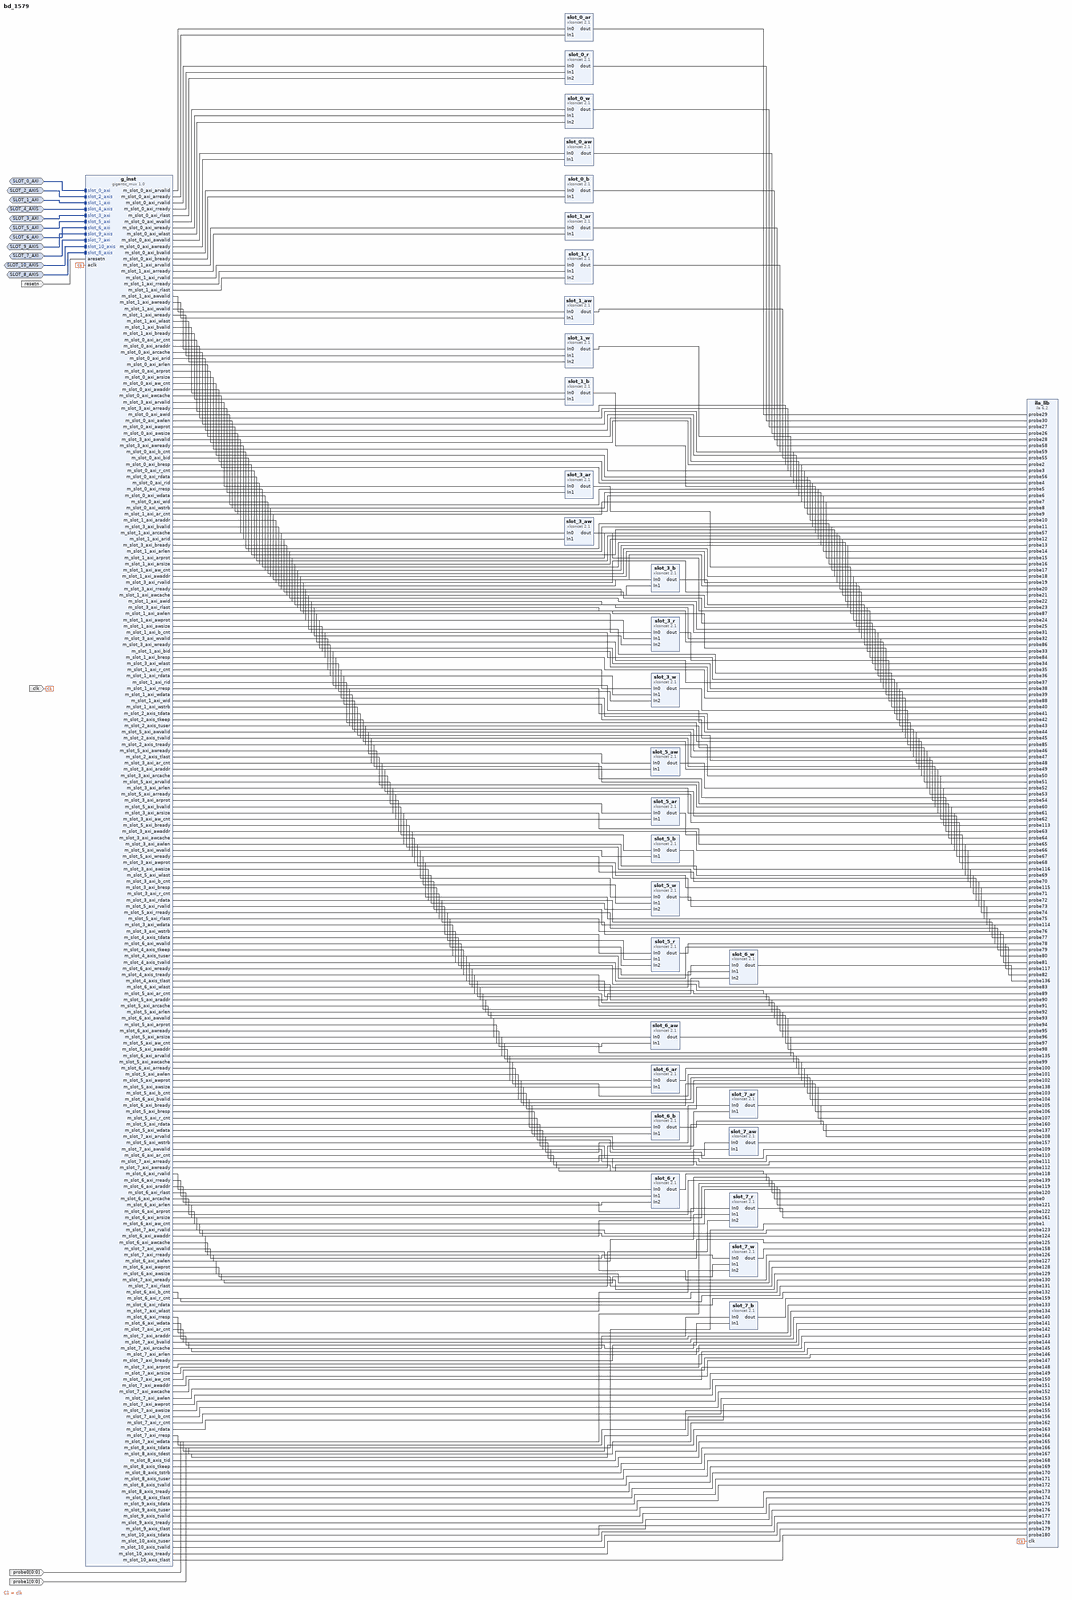
[diagram p0: block diagram of the top level, whole]
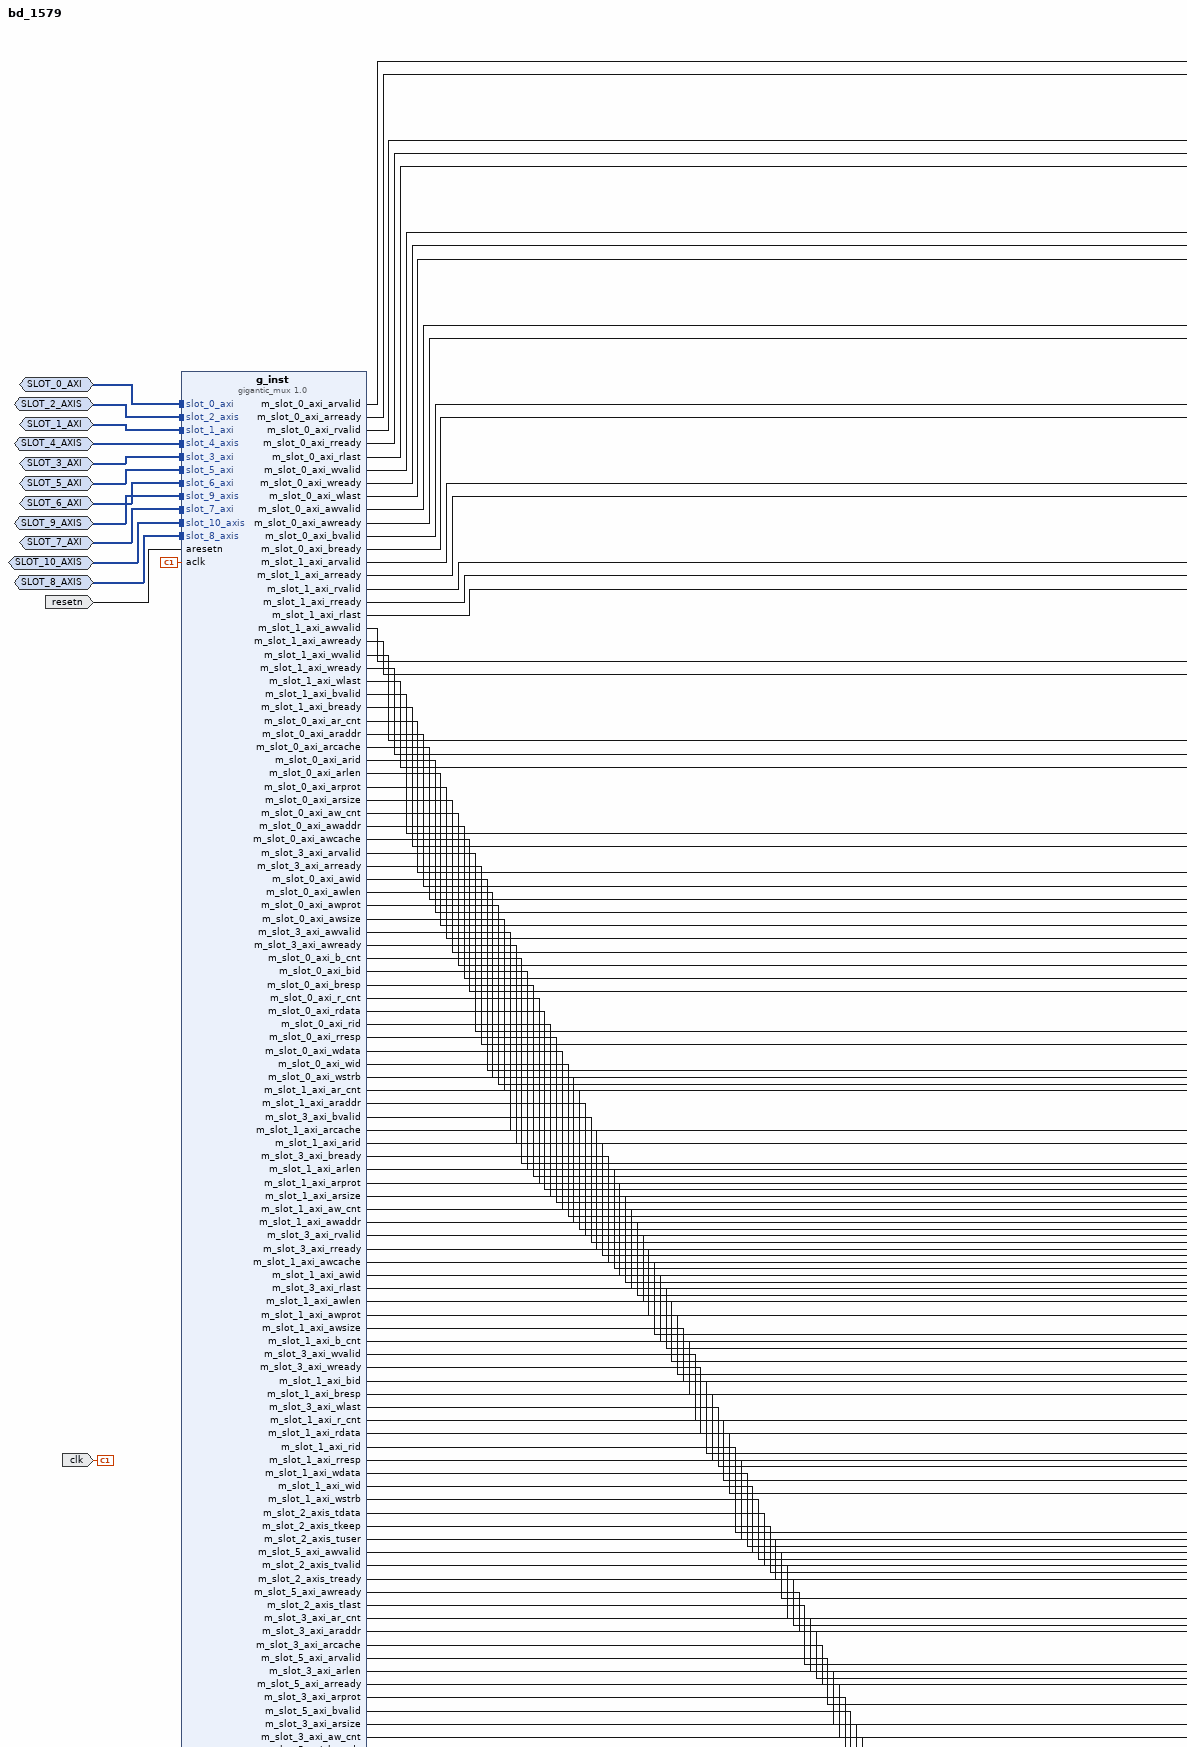
[diagram p1: block diagram of the top level, upper left part]
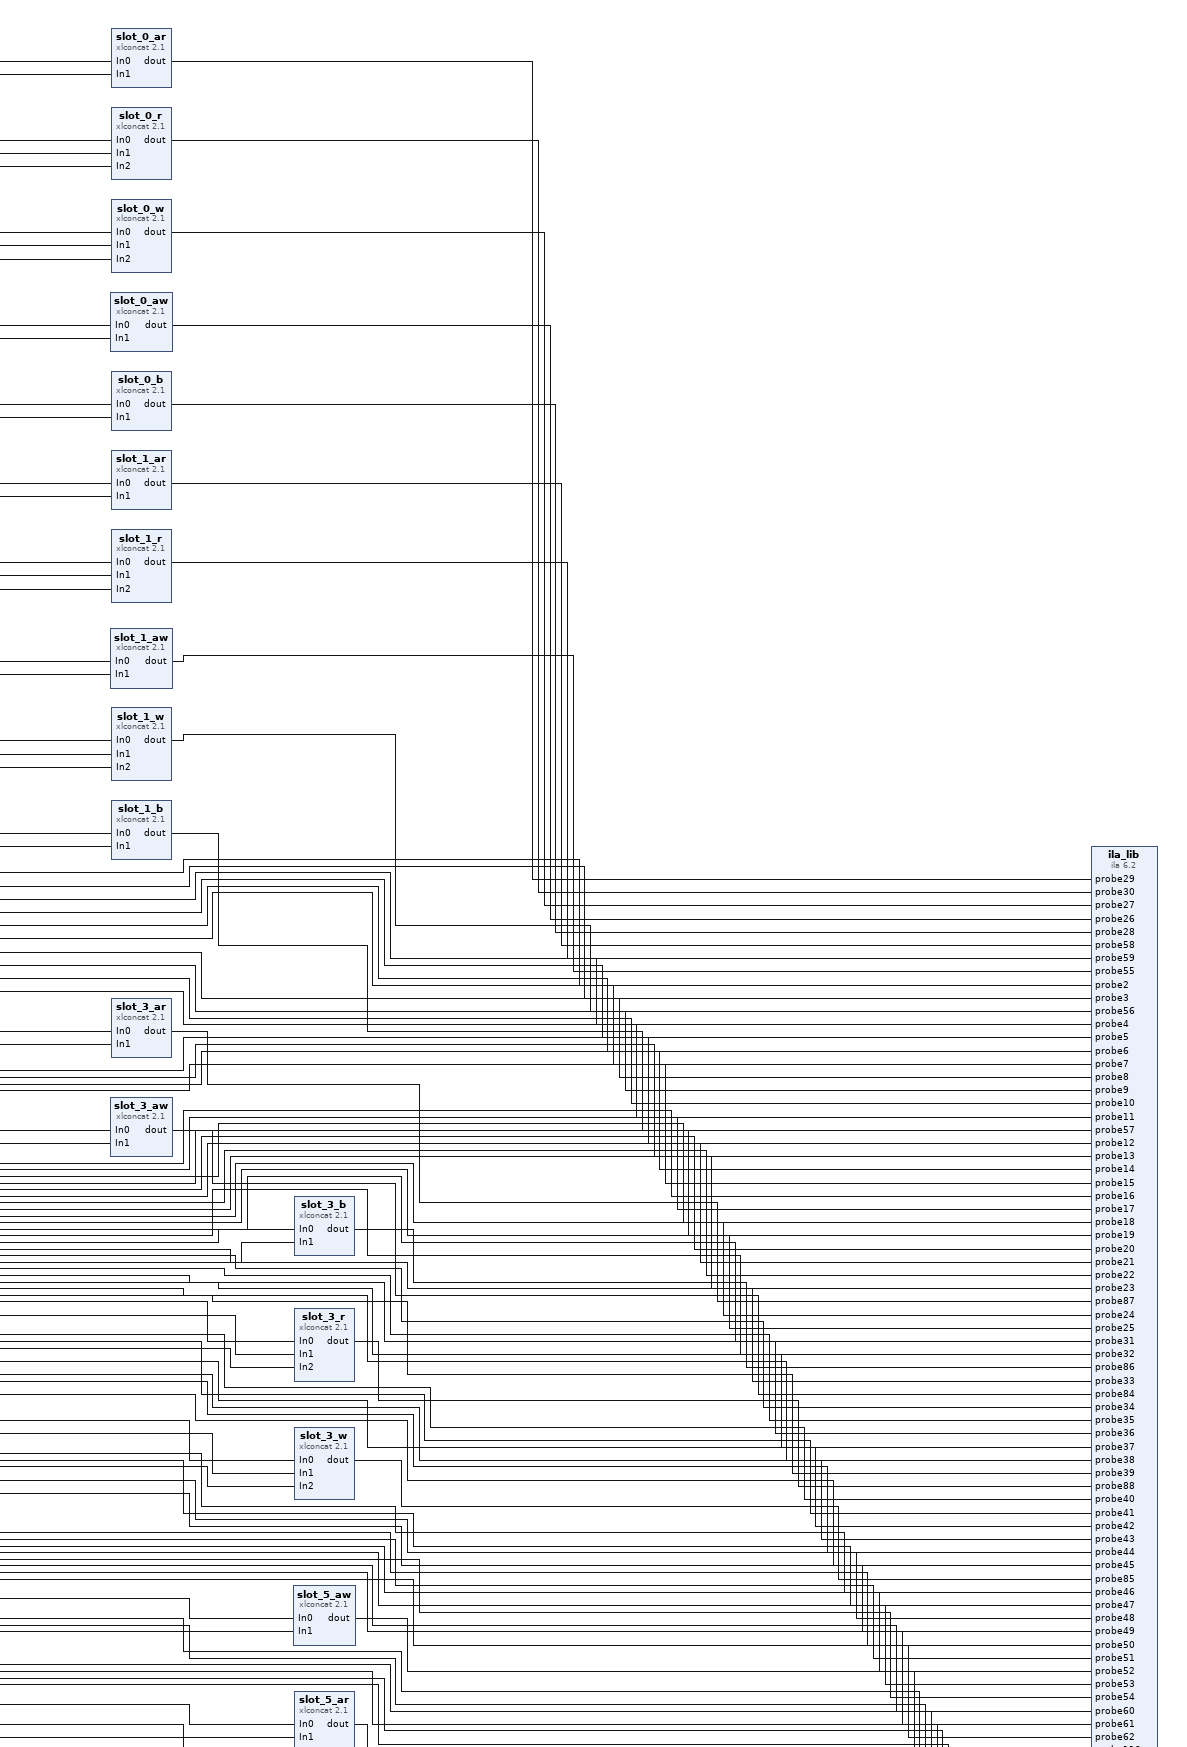
[diagram p2: block diagram of the top level, upper right part]
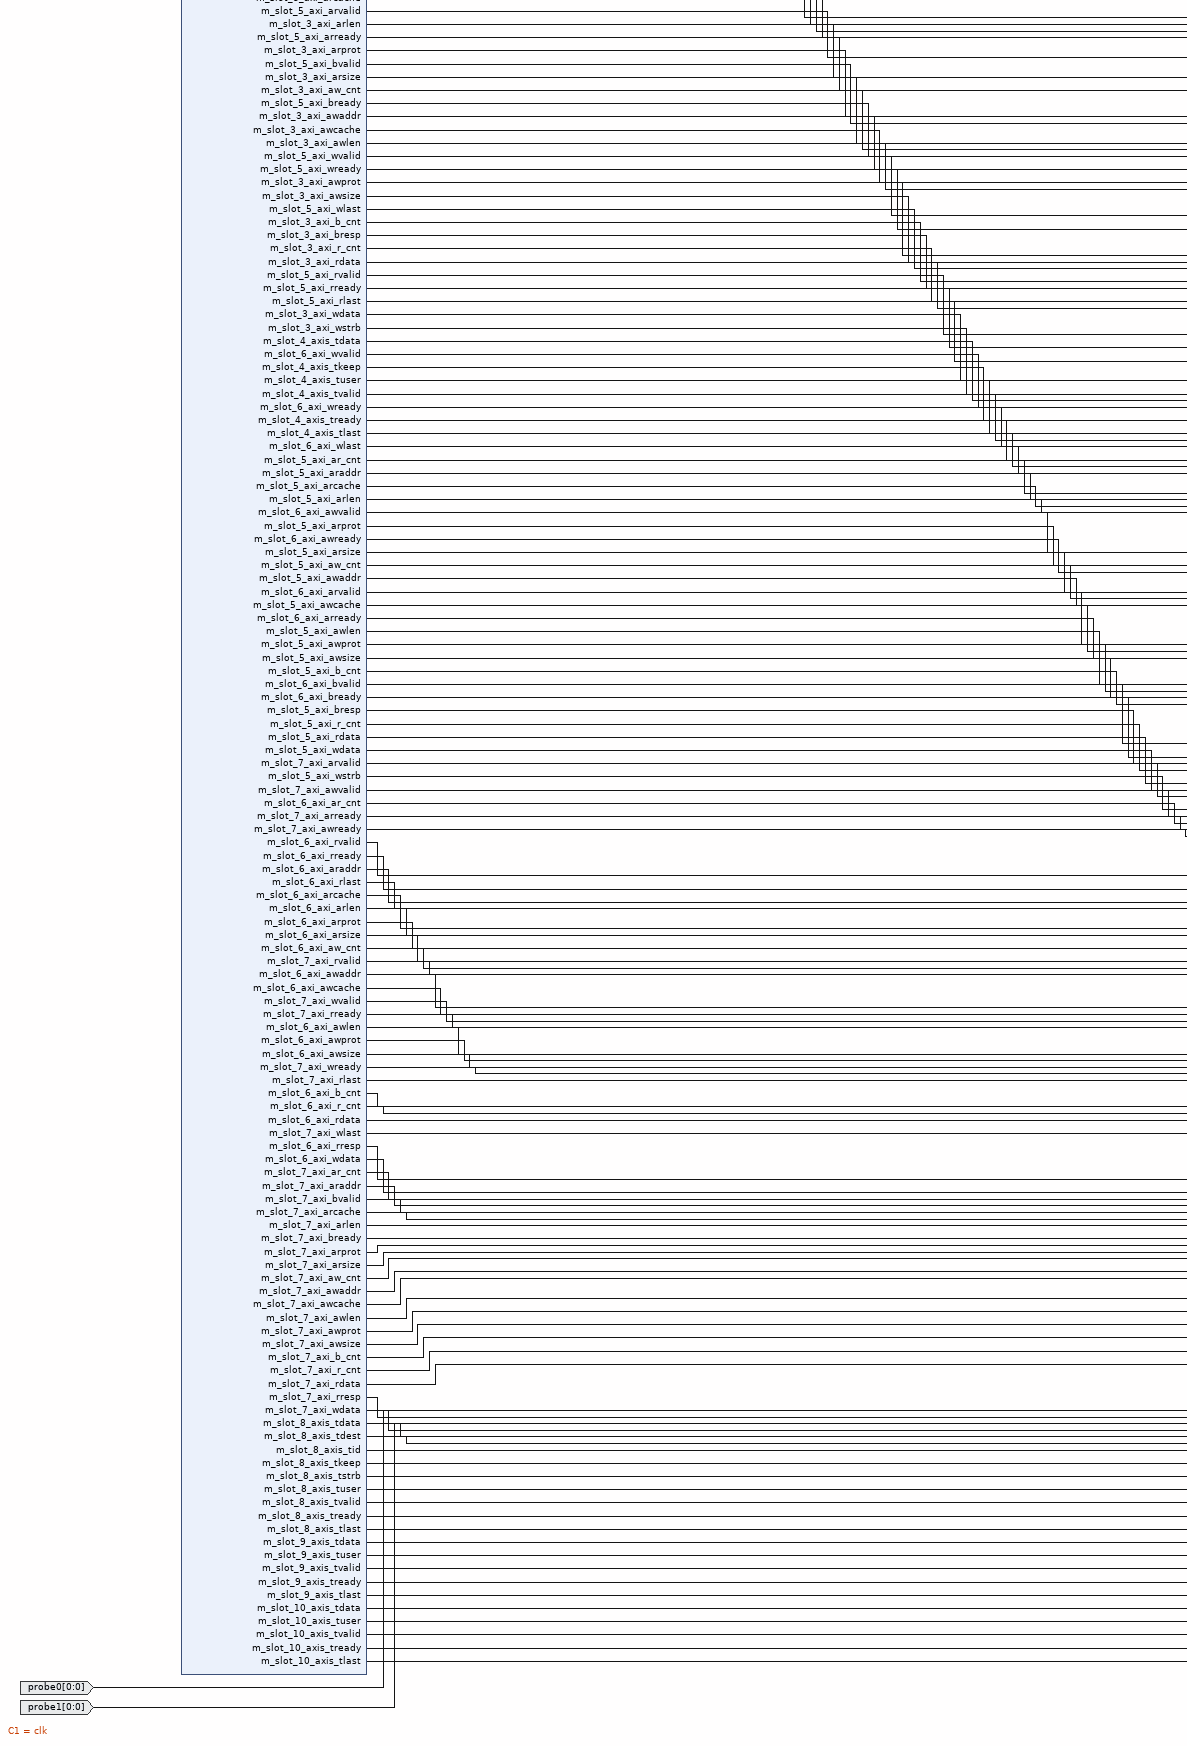
[diagram p3: block diagram of the top level, lower left part]
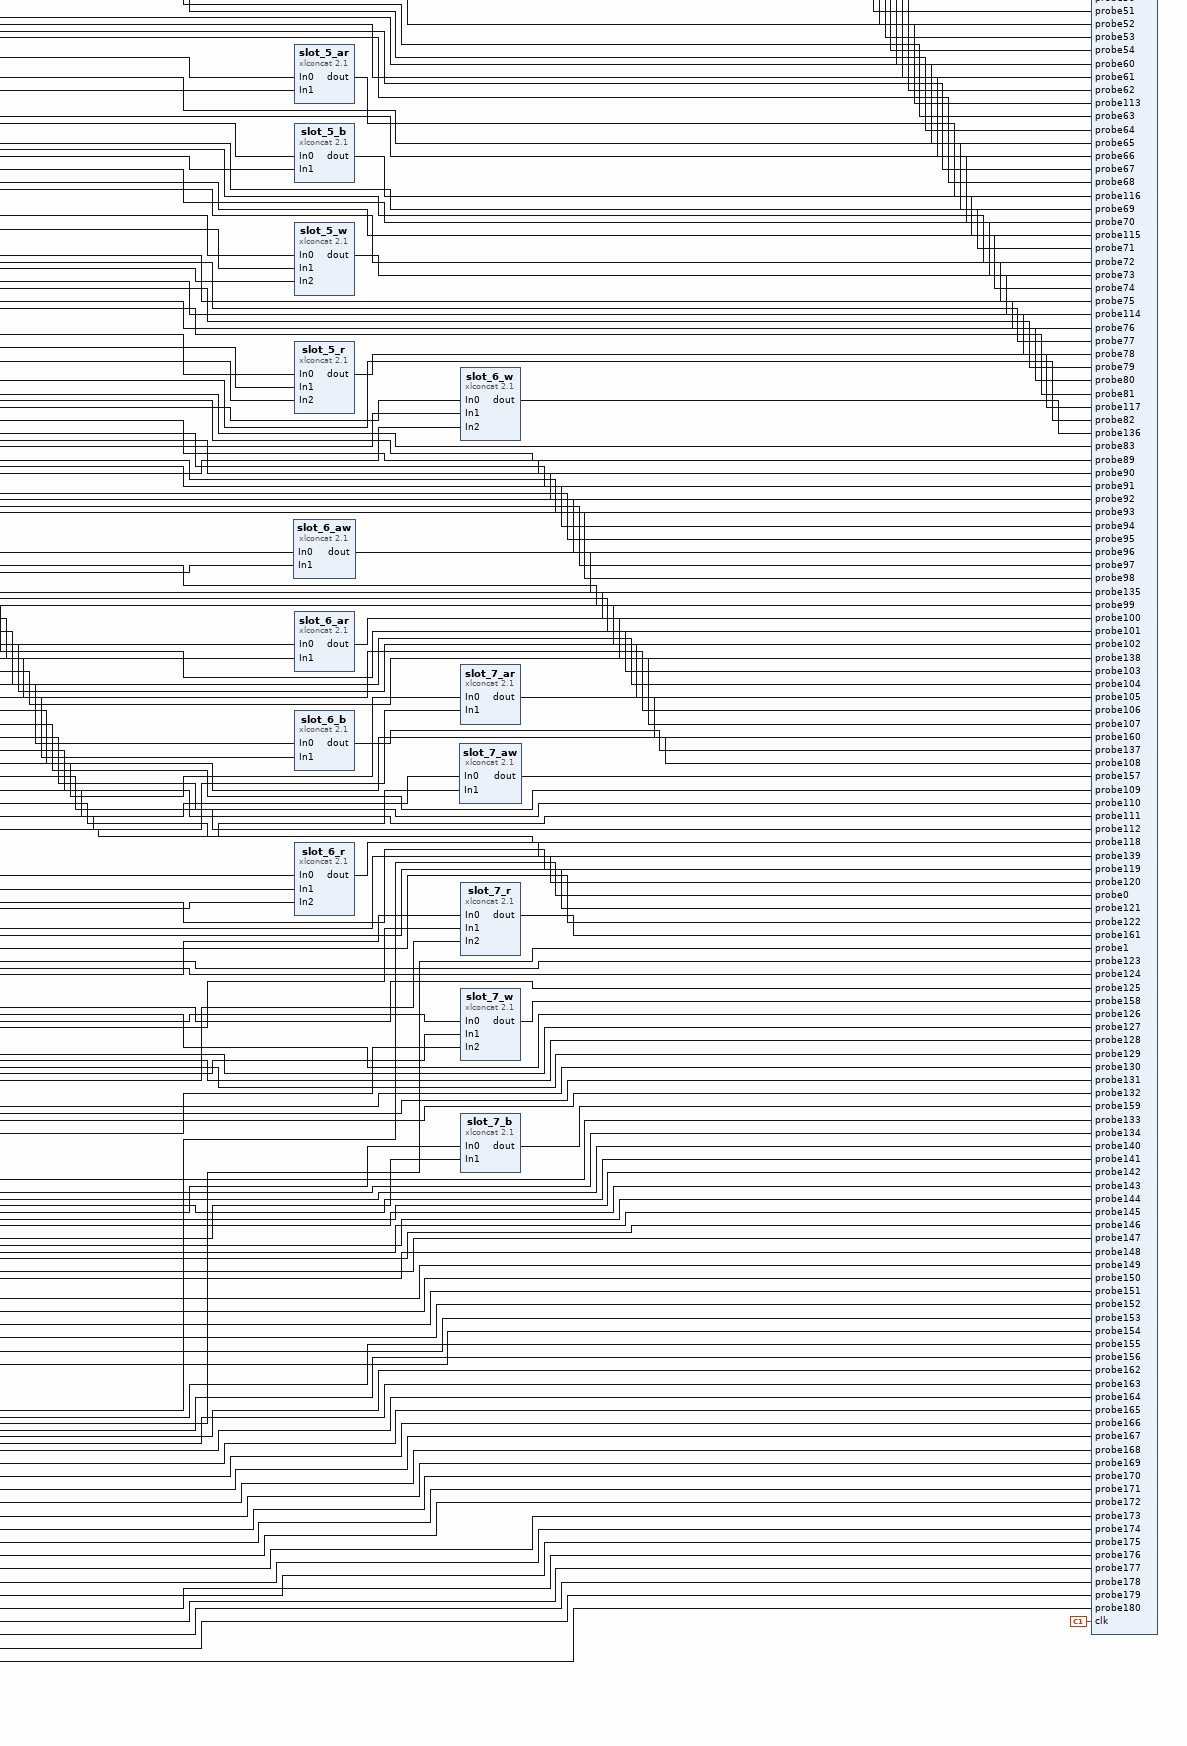
[diagram p4: block diagram of the top level, lower right part]
# Vivado block design bd_1579, xc7z020clg400-2, Vivado 2019.2
create_bd_design bd_1579

create_bd_intf_port -mode Monitor -vlnv xilinx.com:interface:aximm_rtl:1.0 SLOT_0_AXI
create_bd_intf_port -mode Monitor -vlnv xilinx.com:interface:aximm_rtl:1.0 SLOT_1_AXI
create_bd_intf_port -mode Monitor -vlnv xilinx.com:interface:axis_rtl:1.0 SLOT_2_AXIS
create_bd_intf_port -mode Monitor -vlnv xilinx.com:interface:aximm_rtl:1.0 SLOT_3_AXI
create_bd_intf_port -mode Monitor -vlnv xilinx.com:interface:axis_rtl:1.0 SLOT_4_AXIS
create_bd_intf_port -mode Monitor -vlnv xilinx.com:interface:aximm_rtl:1.0 SLOT_5_AXI
create_bd_intf_port -mode Monitor -vlnv xilinx.com:interface:aximm_rtl:1.0 SLOT_6_AXI
create_bd_intf_port -mode Monitor -vlnv xilinx.com:interface:aximm_rtl:1.0 SLOT_7_AXI
create_bd_intf_port -mode Monitor -vlnv xilinx.com:interface:axis_rtl:1.0 SLOT_8_AXIS
create_bd_intf_port -mode Monitor -vlnv xilinx.com:interface:axis_rtl:1.0 SLOT_9_AXIS
create_bd_intf_port -mode Monitor -vlnv xilinx.com:interface:axis_rtl:1.0 SLOT_10_AXIS
create_bd_port -dir I -type clk clk
set_property -dict [list \
  CONFIG.ASSOCIATED_BUSIF SLOT_0_AXI:SLOT_10_AXIS:SLOT_1_AXI:SLOT_2_AXIS:SLOT_3_AXI:SLOT_4_AXIS:SLOT_5_AXI:SLOT_6_AXI:SLOT_7_AXI:SLOT_8_AXIS:SLOT_9_AXIS \
  CONFIG.ASSOCIATED_RESET resetn \
] [get_bd_ports clk]
create_bd_port -dir I -from 0 -to 0 probe0
create_bd_port -dir I -from 0 -to 0 probe1
create_bd_port -dir I -type rst resetn

create_bd_cell -type ip -vlnv xilinx.com:ip:ila:6.2 ila_lib
set_property -dict [list \
  CONFIG.ALL_PROBE_SAME_MU TRUE \
  CONFIG.ALL_PROBE_SAME_MU_CNT 1 \
  CONFIG.C_ADV_TRIGGER FALSE \
  CONFIG.C_DATA_DEPTH 1024 \
  CONFIG.C_EN_STRG_QUAL 0 \
  CONFIG.C_EN_TIME_TAG 0 \
  CONFIG.C_ILA_CLK_FREQ 100000000 \
  CONFIG.C_INPUT_PIPE_STAGES 0 \
  CONFIG.C_MONITOR_TYPE Native \
  CONFIG.C_NUM_OF_PROBES 181 \
  CONFIG.C_PROBE0_MU_CNT 1 \
  CONFIG.C_PROBE0_TYPE 0 \
  CONFIG.C_PROBE0_WIDTH 1 \
  CONFIG.C_PROBE100_TYPE 0 \
  CONFIG.C_PROBE100_WIDTH 3 \
  CONFIG.C_PROBE101_TYPE 0 \
  CONFIG.C_PROBE101_WIDTH 2 \
  CONFIG.C_PROBE102_TYPE 0 \
  CONFIG.C_PROBE102_WIDTH 32 \
  CONFIG.C_PROBE103_TYPE 0 \
  CONFIG.C_PROBE103_WIDTH 4 \
  CONFIG.C_PROBE104_TYPE 0 \
  CONFIG.C_PROBE104_WIDTH 8 \
  CONFIG.C_PROBE105_TYPE 0 \
  CONFIG.C_PROBE105_WIDTH 3 \
  CONFIG.C_PROBE106_TYPE 0 \
  CONFIG.C_PROBE106_WIDTH 3 \
  CONFIG.C_PROBE107_TYPE 0 \
  CONFIG.C_PROBE107_WIDTH 2 \
  CONFIG.C_PROBE108_TYPE 0 \
  CONFIG.C_PROBE108_WIDTH 2 \
  CONFIG.C_PROBE109_TYPE 0 \
  CONFIG.C_PROBE109_WIDTH 2 \
  CONFIG.C_PROBE10_TYPE 0 \
  CONFIG.C_PROBE10_WIDTH 32 \
  CONFIG.C_PROBE110_TYPE 0 \
  CONFIG.C_PROBE110_WIDTH 64 \
  CONFIG.C_PROBE111_TYPE 0 \
  CONFIG.C_PROBE111_WIDTH 64 \
  CONFIG.C_PROBE112_TYPE 0 \
  CONFIG.C_PROBE112_WIDTH 8 \
  CONFIG.C_PROBE113_TYPE 0 \
  CONFIG.C_PROBE113_WIDTH 2 \
  CONFIG.C_PROBE114_TYPE 0 \
  CONFIG.C_PROBE114_WIDTH 3 \
  CONFIG.C_PROBE115_TYPE 0 \
  CONFIG.C_PROBE115_WIDTH 2 \
  CONFIG.C_PROBE116_TYPE 0 \
  CONFIG.C_PROBE116_WIDTH 2 \
  CONFIG.C_PROBE117_TYPE 0 \
  CONFIG.C_PROBE117_WIDTH 3 \
  CONFIG.C_PROBE118_TYPE 0 \
  CONFIG.C_PROBE118_WIDTH 2 \
  CONFIG.C_PROBE119_TYPE 0 \
  CONFIG.C_PROBE119_WIDTH 32 \
  CONFIG.C_PROBE11_TYPE 0 \
  CONFIG.C_PROBE11_WIDTH 4 \
  CONFIG.C_PROBE120_TYPE 0 \
  CONFIG.C_PROBE120_WIDTH 4 \
  CONFIG.C_PROBE121_TYPE 0 \
  CONFIG.C_PROBE121_WIDTH 8 \
  CONFIG.C_PROBE122_TYPE 0 \
  CONFIG.C_PROBE122_WIDTH 3 \
  CONFIG.C_PROBE123_TYPE 0 \
  CONFIG.C_PROBE123_WIDTH 3 \
  CONFIG.C_PROBE124_TYPE 0 \
  CONFIG.C_PROBE124_WIDTH 2 \
  CONFIG.C_PROBE125_TYPE 0 \
  CONFIG.C_PROBE125_WIDTH 32 \
  CONFIG.C_PROBE126_TYPE 0 \
  CONFIG.C_PROBE126_WIDTH 4 \
  CONFIG.C_PROBE127_TYPE 0 \
  CONFIG.C_PROBE127_WIDTH 8 \
  CONFIG.C_PROBE128_TYPE 0 \
  CONFIG.C_PROBE128_WIDTH 3 \
  CONFIG.C_PROBE129_TYPE 0 \
  CONFIG.C_PROBE129_WIDTH 3 \
  CONFIG.C_PROBE12_TYPE 0 \
  CONFIG.C_PROBE12_WIDTH 1 \
  CONFIG.C_PROBE130_TYPE 0 \
  CONFIG.C_PROBE130_WIDTH 2 \
  CONFIG.C_PROBE131_TYPE 0 \
  CONFIG.C_PROBE131_WIDTH 2 \
  CONFIG.C_PROBE132_TYPE 0 \
  CONFIG.C_PROBE132_WIDTH 64 \
  CONFIG.C_PROBE133_TYPE 0 \
  CONFIG.C_PROBE133_WIDTH 2 \
  CONFIG.C_PROBE134_TYPE 0 \
  CONFIG.C_PROBE134_WIDTH 64 \
  CONFIG.C_PROBE135_TYPE 0 \
  CONFIG.C_PROBE135_WIDTH 2 \
  CONFIG.C_PROBE136_TYPE 0 \
  CONFIG.C_PROBE136_WIDTH 3 \
  CONFIG.C_PROBE137_TYPE 0 \
  CONFIG.C_PROBE137_WIDTH 2 \
  CONFIG.C_PROBE138_TYPE 0 \
  CONFIG.C_PROBE138_WIDTH 2 \
  CONFIG.C_PROBE139_TYPE 0 \
  CONFIG.C_PROBE139_WIDTH 3 \
  CONFIG.C_PROBE13_TYPE 0 \
  CONFIG.C_PROBE13_WIDTH 4 \
  CONFIG.C_PROBE140_TYPE 0 \
  CONFIG.C_PROBE140_WIDTH 2 \
  CONFIG.C_PROBE141_TYPE 0 \
  CONFIG.C_PROBE141_WIDTH 32 \
  CONFIG.C_PROBE142_TYPE 0 \
  CONFIG.C_PROBE142_WIDTH 4 \
  CONFIG.C_PROBE143_TYPE 0 \
  CONFIG.C_PROBE143_WIDTH 8 \
  CONFIG.C_PROBE144_TYPE 0 \
  CONFIG.C_PROBE144_WIDTH 3 \
  CONFIG.C_PROBE145_TYPE 0 \
  CONFIG.C_PROBE145_WIDTH 3 \
  CONFIG.C_PROBE146_TYPE 0 \
  CONFIG.C_PROBE146_WIDTH 2 \
  CONFIG.C_PROBE147_TYPE 0 \
  CONFIG.C_PROBE147_WIDTH 32 \
  CONFIG.C_PROBE148_TYPE 0 \
  CONFIG.C_PROBE148_WIDTH 4 \
  CONFIG.C_PROBE149_TYPE 0 \
  CONFIG.C_PROBE149_WIDTH 8 \
  CONFIG.C_PROBE14_TYPE 0 \
  CONFIG.C_PROBE14_WIDTH 3 \
  CONFIG.C_PROBE150_TYPE 0 \
  CONFIG.C_PROBE150_WIDTH 3 \
  CONFIG.C_PROBE151_TYPE 0 \
  CONFIG.C_PROBE151_WIDTH 3 \
  CONFIG.C_PROBE152_TYPE 0 \
  CONFIG.C_PROBE152_WIDTH 2 \
  CONFIG.C_PROBE153_TYPE 0 \
  CONFIG.C_PROBE153_WIDTH 2 \
  CONFIG.C_PROBE154_TYPE 0 \
  CONFIG.C_PROBE154_WIDTH 64 \
  CONFIG.C_PROBE155_TYPE 0 \
  CONFIG.C_PROBE155_WIDTH 2 \
  CONFIG.C_PROBE156_TYPE 0 \
  CONFIG.C_PROBE156_WIDTH 64 \
  CONFIG.C_PROBE157_TYPE 0 \
  CONFIG.C_PROBE157_WIDTH 2 \
  CONFIG.C_PROBE158_TYPE 0 \
  CONFIG.C_PROBE158_WIDTH 3 \
  CONFIG.C_PROBE159_TYPE 0 \
  CONFIG.C_PROBE159_WIDTH 2 \
  CONFIG.C_PROBE15_TYPE 0 \
  CONFIG.C_PROBE15_WIDTH 3 \
  CONFIG.C_PROBE160_TYPE 0 \
  CONFIG.C_PROBE160_WIDTH 2 \
  CONFIG.C_PROBE161_TYPE 0 \
  CONFIG.C_PROBE161_WIDTH 3 \
  CONFIG.C_PROBE162_TYPE 0 \
  CONFIG.C_PROBE162_WIDTH 24 \
  CONFIG.C_PROBE163_TYPE 0 \
  CONFIG.C_PROBE163_WIDTH 1 \
  CONFIG.C_PROBE164_TYPE 0 \
  CONFIG.C_PROBE164_WIDTH 1 \
  CONFIG.C_PROBE165_TYPE 0 \
  CONFIG.C_PROBE165_WIDTH 3 \
  CONFIG.C_PROBE166_TYPE 0 \
  CONFIG.C_PROBE166_WIDTH 3 \
  CONFIG.C_PROBE167_TYPE 0 \
  CONFIG.C_PROBE167_WIDTH 1 \
  CONFIG.C_PROBE168_TYPE 0 \
  CONFIG.C_PROBE168_WIDTH 1 \
  CONFIG.C_PROBE169_TYPE 0 \
  CONFIG.C_PROBE169_WIDTH 1 \
  CONFIG.C_PROBE16_TYPE 0 \
  CONFIG.C_PROBE16_WIDTH 2 \
  CONFIG.C_PROBE170_TYPE 0 \
  CONFIG.C_PROBE170_WIDTH 1 \
  CONFIG.C_PROBE171_TYPE 0 \
  CONFIG.C_PROBE171_WIDTH 24 \
  CONFIG.C_PROBE172_TYPE 0 \
  CONFIG.C_PROBE172_WIDTH 1 \
  CONFIG.C_PROBE173_TYPE 0 \
  CONFIG.C_PROBE173_WIDTH 1 \
  CONFIG.C_PROBE174_TYPE 0 \
  CONFIG.C_PROBE174_WIDTH 1 \
  CONFIG.C_PROBE175_TYPE 0 \
  CONFIG.C_PROBE175_WIDTH 1 \
  CONFIG.C_PROBE176_TYPE 0 \
  CONFIG.C_PROBE176_WIDTH 24 \
  CONFIG.C_PROBE177_TYPE 0 \
  CONFIG.C_PROBE177_WIDTH 1 \
  CONFIG.C_PROBE178_TYPE 0 \
  CONFIG.C_PROBE178_WIDTH 1 \
  CONFIG.C_PROBE179_TYPE 0 \
  CONFIG.C_PROBE179_WIDTH 1 \
  CONFIG.C_PROBE17_TYPE 0 \
  CONFIG.C_PROBE17_WIDTH 1 \
  CONFIG.C_PROBE180_TYPE 0 \
  CONFIG.C_PROBE180_WIDTH 1 \
  CONFIG.C_PROBE18_TYPE 0 \
  CONFIG.C_PROBE18_WIDTH 2 \
  CONFIG.C_PROBE19_TYPE 0 \
  CONFIG.C_PROBE19_WIDTH 2 \
  CONFIG.C_PROBE1_MU_CNT 1 \
  CONFIG.C_PROBE1_TYPE 0 \
  CONFIG.C_PROBE1_WIDTH 1 \
  CONFIG.C_PROBE20_TYPE 0 \
  CONFIG.C_PROBE20_WIDTH 64 \
  CONFIG.C_PROBE21_TYPE 0 \
  CONFIG.C_PROBE21_WIDTH 1 \
  CONFIG.C_PROBE22_TYPE 0 \
  CONFIG.C_PROBE22_WIDTH 2 \
  CONFIG.C_PROBE23_TYPE 0 \
  CONFIG.C_PROBE23_WIDTH 64 \
  CONFIG.C_PROBE24_TYPE 0 \
  CONFIG.C_PROBE24_WIDTH 1 \
  CONFIG.C_PROBE25_TYPE 0 \
  CONFIG.C_PROBE25_WIDTH 8 \
  CONFIG.C_PROBE26_TYPE 0 \
  CONFIG.C_PROBE26_WIDTH 2 \
  CONFIG.C_PROBE27_TYPE 0 \
  CONFIG.C_PROBE27_WIDTH 3 \
  CONFIG.C_PROBE28_TYPE 0 \
  CONFIG.C_PROBE28_WIDTH 2 \
  CONFIG.C_PROBE29_TYPE 0 \
  CONFIG.C_PROBE29_WIDTH 2 \
  CONFIG.C_PROBE2_TYPE 0 \
  CONFIG.C_PROBE2_WIDTH 2 \
  CONFIG.C_PROBE30_TYPE 0 \
  CONFIG.C_PROBE30_WIDTH 3 \
  CONFIG.C_PROBE31_TYPE 0 \
  CONFIG.C_PROBE31_WIDTH 2 \
  CONFIG.C_PROBE32_TYPE 0 \
  CONFIG.C_PROBE32_WIDTH 32 \
  CONFIG.C_PROBE33_TYPE 0 \
  CONFIG.C_PROBE33_WIDTH 4 \
  CONFIG.C_PROBE34_TYPE 0 \
  CONFIG.C_PROBE34_WIDTH 1 \
  CONFIG.C_PROBE35_TYPE 0 \
  CONFIG.C_PROBE35_WIDTH 4 \
  CONFIG.C_PROBE36_TYPE 0 \
  CONFIG.C_PROBE36_WIDTH 3 \
  CONFIG.C_PROBE37_TYPE 0 \
  CONFIG.C_PROBE37_WIDTH 3 \
  CONFIG.C_PROBE38_TYPE 0 \
  CONFIG.C_PROBE38_WIDTH 2 \
  CONFIG.C_PROBE39_TYPE 0 \
  CONFIG.C_PROBE39_WIDTH 32 \
  CONFIG.C_PROBE3_TYPE 0 \
  CONFIG.C_PROBE3_WIDTH 32 \
  CONFIG.C_PROBE40_TYPE 0 \
  CONFIG.C_PROBE40_WIDTH 4 \
  CONFIG.C_PROBE41_TYPE 0 \
  CONFIG.C_PROBE41_WIDTH 1 \
  CONFIG.C_PROBE42_TYPE 0 \
  CONFIG.C_PROBE42_WIDTH 4 \
  CONFIG.C_PROBE43_TYPE 0 \
  CONFIG.C_PROBE43_WIDTH 3 \
  CONFIG.C_PROBE44_TYPE 0 \
  CONFIG.C_PROBE44_WIDTH 3 \
  CONFIG.C_PROBE45_TYPE 0 \
  CONFIG.C_PROBE45_WIDTH 2 \
  CONFIG.C_PROBE46_TYPE 0 \
  CONFIG.C_PROBE46_WIDTH 1 \
  CONFIG.C_PROBE47_TYPE 0 \
  CONFIG.C_PROBE47_WIDTH 2 \
  CONFIG.C_PROBE48_TYPE 0 \
  CONFIG.C_PROBE48_WIDTH 2 \
  CONFIG.C_PROBE49_TYPE 0 \
  CONFIG.C_PROBE49_WIDTH 64 \
  CONFIG.C_PROBE4_TYPE 0 \
  CONFIG.C_PROBE4_WIDTH 4 \
  CONFIG.C_PROBE50_TYPE 0 \
  CONFIG.C_PROBE50_WIDTH 1 \
  CONFIG.C_PROBE51_TYPE 0 \
  CONFIG.C_PROBE51_WIDTH 2 \
  CONFIG.C_PROBE52_TYPE 0 \
  CONFIG.C_PROBE52_WIDTH 64 \
  CONFIG.C_PROBE53_TYPE 0 \
  CONFIG.C_PROBE53_WIDTH 1 \
  CONFIG.C_PROBE54_TYPE 0 \
  CONFIG.C_PROBE54_WIDTH 8 \
  CONFIG.C_PROBE55_TYPE 0 \
  CONFIG.C_PROBE55_WIDTH 2 \
  CONFIG.C_PROBE56_TYPE 0 \
  CONFIG.C_PROBE56_WIDTH 3 \
  CONFIG.C_PROBE57_TYPE 0 \
  CONFIG.C_PROBE57_WIDTH 2 \
  CONFIG.C_PROBE58_TYPE 0 \
  CONFIG.C_PROBE58_WIDTH 2 \
  CONFIG.C_PROBE59_TYPE 0 \
  CONFIG.C_PROBE59_WIDTH 3 \
  CONFIG.C_PROBE5_TYPE 0 \
  CONFIG.C_PROBE5_WIDTH 1 \
  CONFIG.C_PROBE60_TYPE 0 \
  CONFIG.C_PROBE60_WIDTH 24 \
  CONFIG.C_PROBE61_TYPE 0 \
  CONFIG.C_PROBE61_WIDTH 3 \
  CONFIG.C_PROBE62_TYPE 0 \
  CONFIG.C_PROBE62_WIDTH 1 \
  CONFIG.C_PROBE63_TYPE 0 \
  CONFIG.C_PROBE63_WIDTH 1 \
  CONFIG.C_PROBE64_TYPE 0 \
  CONFIG.C_PROBE64_WIDTH 1 \
  CONFIG.C_PROBE65_TYPE 0 \
  CONFIG.C_PROBE65_WIDTH 1 \
  CONFIG.C_PROBE66_TYPE 0 \
  CONFIG.C_PROBE66_WIDTH 2 \
  CONFIG.C_PROBE67_TYPE 0 \
  CONFIG.C_PROBE67_WIDTH 32 \
  CONFIG.C_PROBE68_TYPE 0 \
  CONFIG.C_PROBE68_WIDTH 4 \
  CONFIG.C_PROBE69_TYPE 0 \
  CONFIG.C_PROBE69_WIDTH 8 \
  CONFIG.C_PROBE6_TYPE 0 \
  CONFIG.C_PROBE6_WIDTH 4 \
  CONFIG.C_PROBE70_TYPE 0 \
  CONFIG.C_PROBE70_WIDTH 3 \
  CONFIG.C_PROBE71_TYPE 0 \
  CONFIG.C_PROBE71_WIDTH 3 \
  CONFIG.C_PROBE72_TYPE 0 \
  CONFIG.C_PROBE72_WIDTH 2 \
  CONFIG.C_PROBE73_TYPE 0 \
  CONFIG.C_PROBE73_WIDTH 32 \
  CONFIG.C_PROBE74_TYPE 0 \
  CONFIG.C_PROBE74_WIDTH 4 \
  CONFIG.C_PROBE75_TYPE 0 \
  CONFIG.C_PROBE75_WIDTH 8 \
  CONFIG.C_PROBE76_TYPE 0 \
  CONFIG.C_PROBE76_WIDTH 3 \
  CONFIG.C_PROBE77_TYPE 0 \
  CONFIG.C_PROBE77_WIDTH 3 \
  CONFIG.C_PROBE78_TYPE 0 \
  CONFIG.C_PROBE78_WIDTH 2 \
  CONFIG.C_PROBE79_TYPE 0 \
  CONFIG.C_PROBE79_WIDTH 2 \
  CONFIG.C_PROBE7_TYPE 0 \
  CONFIG.C_PROBE7_WIDTH 3 \
  CONFIG.C_PROBE80_TYPE 0 \
  CONFIG.C_PROBE80_WIDTH 2 \
  CONFIG.C_PROBE81_TYPE 0 \
  CONFIG.C_PROBE81_WIDTH 64 \
  CONFIG.C_PROBE82_TYPE 0 \
  CONFIG.C_PROBE82_WIDTH 64 \
  CONFIG.C_PROBE83_TYPE 0 \
  CONFIG.C_PROBE83_WIDTH 8 \
  CONFIG.C_PROBE84_TYPE 0 \
  CONFIG.C_PROBE84_WIDTH 2 \
  CONFIG.C_PROBE85_TYPE 0 \
  CONFIG.C_PROBE85_WIDTH 3 \
  CONFIG.C_PROBE86_TYPE 0 \
  CONFIG.C_PROBE86_WIDTH 2 \
  CONFIG.C_PROBE87_TYPE 0 \
  CONFIG.C_PROBE87_WIDTH 2 \
  CONFIG.C_PROBE88_TYPE 0 \
  CONFIG.C_PROBE88_WIDTH 3 \
  CONFIG.C_PROBE89_TYPE 0 \
  CONFIG.C_PROBE89_WIDTH 24 \
  CONFIG.C_PROBE8_TYPE 0 \
  CONFIG.C_PROBE8_WIDTH 3 \
  CONFIG.C_PROBE90_TYPE 0 \
  CONFIG.C_PROBE90_WIDTH 3 \
  CONFIG.C_PROBE91_TYPE 0 \
  CONFIG.C_PROBE91_WIDTH 1 \
  CONFIG.C_PROBE92_TYPE 0 \
  CONFIG.C_PROBE92_WIDTH 1 \
  CONFIG.C_PROBE93_TYPE 0 \
  CONFIG.C_PROBE93_WIDTH 1 \
  CONFIG.C_PROBE94_TYPE 0 \
  CONFIG.C_PROBE94_WIDTH 1 \
  CONFIG.C_PROBE95_TYPE 0 \
  CONFIG.C_PROBE95_WIDTH 2 \
  CONFIG.C_PROBE96_TYPE 0 \
  CONFIG.C_PROBE96_WIDTH 32 \
  CONFIG.C_PROBE97_TYPE 0 \
  CONFIG.C_PROBE97_WIDTH 4 \
  CONFIG.C_PROBE98_TYPE 0 \
  CONFIG.C_PROBE98_WIDTH 8 \
  CONFIG.C_PROBE99_TYPE 0 \
  CONFIG.C_PROBE99_WIDTH 3 \
  CONFIG.C_PROBE9_TYPE 0 \
  CONFIG.C_PROBE9_WIDTH 2 \
  CONFIG.C_TIME_TAG_WIDTH 32 \
  CONFIG.C_TRIGIN_EN false \
  CONFIG.C_TRIGOUT_EN false \
  CONFIG.C_XLNX_HW_PROBE_INFO DEFAULT \
] [get_bd_cells ila_lib]
create_bd_cell -type ip -vlnv xilinx.com:ip:gigantic_mux:1.0 g_inst
set_property -dict [list \
  CONFIG.C_EN_GIGAMUX false \
  CONFIG.C_NUM_MONITOR_SLOTS 11 \
  CONFIG.C_NUM_OF_PROBES 0 \
  CONFIG.C_SLOT_0_AXI_ADDR_WIDTH 32 \
  CONFIG.C_SLOT_0_AXI_ARUSER_WIDTH 0 \
  CONFIG.C_SLOT_0_AXI_AR_SEL 1 \
  CONFIG.C_SLOT_0_AXI_AWUSER_WIDTH 0 \
  CONFIG.C_SLOT_0_AXI_AW_SEL 1 \
  CONFIG.C_SLOT_0_AXI_AXLEN_WIDTH 4 \
  CONFIG.C_SLOT_0_AXI_AXLOCK_WIDTH 2 \
  CONFIG.C_SLOT_0_AXI_BUSER_WIDTH 0 \
  CONFIG.C_SLOT_0_AXI_B_SEL 1 \
  CONFIG.C_SLOT_0_AXI_DATA_WIDTH 64 \
  CONFIG.C_SLOT_0_AXI_ID_WIDTH 1 \
  CONFIG.C_SLOT_0_AXI_PROTOCOL AXI3 \
  CONFIG.C_SLOT_0_AXI_RUSER_WIDTH 0 \
  CONFIG.C_SLOT_0_AXI_R_SEL 1 \
  CONFIG.C_SLOT_0_AXI_WUSER_WIDTH 0 \
  CONFIG.C_SLOT_0_AXI_W_SEL 1 \
  CONFIG.C_SLOT_0_HAS_BRESP 1 \
  CONFIG.C_SLOT_0_HAS_BURST 0 \
  CONFIG.C_SLOT_0_HAS_CACHE 1 \
  CONFIG.C_SLOT_0_HAS_LOCK 0 \
  CONFIG.C_SLOT_0_HAS_PROT 1 \
  CONFIG.C_SLOT_0_HAS_QOS 0 \
  CONFIG.C_SLOT_0_HAS_REGION 0 \
  CONFIG.C_SLOT_0_HAS_RRESP 1 \
  CONFIG.C_SLOT_0_HAS_WSTRB 1 \
  CONFIG.C_SLOT_0_MAX_RD_BURSTS 1 \
  CONFIG.C_SLOT_0_MAX_WR_BURSTS 1 \
  CONFIG.C_SLOT_0_MON_MODE FT \
  CONFIG.C_SLOT_0_TXN_CNTR_EN 1 \
  CONFIG.C_SLOT_10_AXIS_TDATA_WIDTH 24 \
  CONFIG.C_SLOT_10_AXIS_TDEST_WIDTH 0 \
  CONFIG.C_SLOT_10_AXIS_TID_WIDTH 0 \
  CONFIG.C_SLOT_10_AXIS_TUSER_WIDTH 1 \
  CONFIG.C_SLOT_10_AXI_PROTOCOL AXI4S \
  CONFIG.C_SLOT_10_HAS_TKEEP 0 \
  CONFIG.C_SLOT_10_HAS_TREADY 1 \
  CONFIG.C_SLOT_10_HAS_TSTRB 0 \
  CONFIG.C_SLOT_10_MON_MODE FT \
  CONFIG.C_SLOT_1_AXI_ADDR_WIDTH 32 \
  CONFIG.C_SLOT_1_AXI_ARUSER_WIDTH 0 \
  CONFIG.C_SLOT_1_AXI_AR_SEL 1 \
  CONFIG.C_SLOT_1_AXI_AWUSER_WIDTH 0 \
  CONFIG.C_SLOT_1_AXI_AW_SEL 1 \
  CONFIG.C_SLOT_1_AXI_AXLEN_WIDTH 4 \
  CONFIG.C_SLOT_1_AXI_AXLOCK_WIDTH 2 \
  CONFIG.C_SLOT_1_AXI_BUSER_WIDTH 0 \
  CONFIG.C_SLOT_1_AXI_B_SEL 1 \
  CONFIG.C_SLOT_1_AXI_DATA_WIDTH 64 \
  CONFIG.C_SLOT_1_AXI_ID_WIDTH 1 \
  CONFIG.C_SLOT_1_AXI_PROTOCOL AXI3 \
  CONFIG.C_SLOT_1_AXI_RUSER_WIDTH 0 \
  CONFIG.C_SLOT_1_AXI_R_SEL 1 \
  CONFIG.C_SLOT_1_AXI_WUSER_WIDTH 0 \
  CONFIG.C_SLOT_1_AXI_W_SEL 1 \
  CONFIG.C_SLOT_1_HAS_BRESP 1 \
  CONFIG.C_SLOT_1_HAS_BURST 0 \
  CONFIG.C_SLOT_1_HAS_CACHE 1 \
  CONFIG.C_SLOT_1_HAS_LOCK 0 \
  CONFIG.C_SLOT_1_HAS_PROT 1 \
  CONFIG.C_SLOT_1_HAS_QOS 0 \
  CONFIG.C_SLOT_1_HAS_REGION 0 \
  CONFIG.C_SLOT_1_HAS_RRESP 1 \
  CONFIG.C_SLOT_1_HAS_WSTRB 1 \
  CONFIG.C_SLOT_1_MAX_RD_BURSTS 1 \
  CONFIG.C_SLOT_1_MAX_WR_BURSTS 1 \
  CONFIG.C_SLOT_1_MON_MODE FT \
  CONFIG.C_SLOT_1_TXN_CNTR_EN 1 \
  CONFIG.C_SLOT_2_AXIS_TDATA_WIDTH 24 \
  CONFIG.C_SLOT_2_AXIS_TDEST_WIDTH 0 \
  CONFIG.C_SLOT_2_AXIS_TID_WIDTH 0 \
  CONFIG.C_SLOT_2_AXIS_TUSER_WIDTH 1 \
  CONFIG.C_SLOT_2_AXI_PROTOCOL AXI4S \
  CONFIG.C_SLOT_2_HAS_TKEEP 1 \
  CONFIG.C_SLOT_2_HAS_TREADY 1 \
  CONFIG.C_SLOT_2_HAS_TSTRB 0 \
  CONFIG.C_SLOT_2_MON_MODE FT \
  CONFIG.C_SLOT_3_AXI_ADDR_WIDTH 32 \
  CONFIG.C_SLOT_3_AXI_ARUSER_WIDTH 0 \
  CONFIG.C_SLOT_3_AXI_AR_SEL 1 \
  CONFIG.C_SLOT_3_AXI_AWUSER_WIDTH 0 \
  CONFIG.C_SLOT_3_AXI_AW_SEL 1 \
  CONFIG.C_SLOT_3_AXI_AXLEN_WIDTH 8 \
  CONFIG.C_SLOT_3_AXI_AXLOCK_WIDTH 1 \
  CONFIG.C_SLOT_3_AXI_BUSER_WIDTH 0 \
  CONFIG.C_SLOT_3_AXI_B_SEL 1 \
  CONFIG.C_SLOT_3_AXI_DATA_WIDTH 64 \
  CONFIG.C_SLOT_3_AXI_ID_WIDTH 0 \
  CONFIG.C_SLOT_3_AXI_PROTOCOL AXI4 \
  CONFIG.C_SLOT_3_AXI_RUSER_WIDTH 0 \
  CONFIG.C_SLOT_3_AXI_R_SEL 1 \
  CONFIG.C_SLOT_3_AXI_WUSER_WIDTH 0 \
  CONFIG.C_SLOT_3_AXI_W_SEL 1 \
  CONFIG.C_SLOT_3_HAS_BRESP 1 \
  CONFIG.C_SLOT_3_HAS_BURST 0 \
  CONFIG.C_SLOT_3_HAS_CACHE 1 \
  CONFIG.C_SLOT_3_HAS_LOCK 0 \
  CONFIG.C_SLOT_3_HAS_PROT 1 \
  CONFIG.C_SLOT_3_HAS_QOS 0 \
  CONFIG.C_SLOT_3_HAS_REGION 0 \
  CONFIG.C_SLOT_3_HAS_RRESP 0 \
  CONFIG.C_SLOT_3_HAS_WSTRB 1 \
  CONFIG.C_SLOT_3_MAX_RD_BURSTS 1 \
  CONFIG.C_SLOT_3_MAX_WR_BURSTS 1 \
  CONFIG.C_SLOT_3_MON_MODE FT \
  CONFIG.C_SLOT_3_TXN_CNTR_EN 1 \
  CONFIG.C_SLOT_4_AXIS_TDATA_WIDTH 24 \
  CONFIG.C_SLOT_4_AXIS_TDEST_WIDTH 0 \
  CONFIG.C_SLOT_4_AXIS_TID_WIDTH 0 \
  CONFIG.C_SLOT_4_AXIS_TUSER_WIDTH 1 \
  CONFIG.C_SLOT_4_AXI_PROTOCOL AXI4S \
  CONFIG.C_SLOT_4_HAS_TKEEP 1 \
  CONFIG.C_SLOT_4_HAS_TREADY 1 \
  CONFIG.C_SLOT_4_HAS_TSTRB 0 \
  CONFIG.C_SLOT_4_MON_MODE FT \
  CONFIG.C_SLOT_5_AXI_ADDR_WIDTH 32 \
  CONFIG.C_SLOT_5_AXI_ARUSER_WIDTH 0 \
  CONFIG.C_SLOT_5_AXI_AR_SEL 1 \
  CONFIG.C_SLOT_5_AXI_AWUSER_WIDTH 0 \
  CONFIG.C_SLOT_5_AXI_AW_SEL 1 \
  CONFIG.C_SLOT_5_AXI_AXLEN_WIDTH 8 \
  CONFIG.C_SLOT_5_AXI_AXLOCK_WIDTH 1 \
  CONFIG.C_SLOT_5_AXI_BUSER_WIDTH 0 \
  CONFIG.C_SLOT_5_AXI_B_SEL 1 \
  CONFIG.C_SLOT_5_AXI_DATA_WIDTH 64 \
  CONFIG.C_SLOT_5_AXI_ID_WIDTH 0 \
  CONFIG.C_SLOT_5_AXI_PROTOCOL AXI4 \
  CONFIG.C_SLOT_5_AXI_RUSER_WIDTH 0 \
  CONFIG.C_SLOT_5_AXI_R_SEL 1 \
  CONFIG.C_SLOT_5_AXI_WUSER_WIDTH 0 \
  CONFIG.C_SLOT_5_AXI_W_SEL 1 \
  CONFIG.C_SLOT_5_HAS_BRESP 1 \
  CONFIG.C_SLOT_5_HAS_BURST 0 \
  CONFIG.C_SLOT_5_HAS_CACHE 1 \
  CONFIG.C_SLOT_5_HAS_LOCK 0 \
  CONFIG.C_SLOT_5_HAS_PROT 1 \
  CONFIG.C_SLOT_5_HAS_QOS 0 \
  CONFIG.C_SLOT_5_HAS_REGION 0 \
  CONFIG.C_SLOT_5_HAS_RRESP 0 \
  CONFIG.C_SLOT_5_HAS_WSTRB 1 \
  CONFIG.C_SLOT_5_MAX_RD_BURSTS 1 \
  CONFIG.C_SLOT_5_MAX_WR_BURSTS 1 \
  CONFIG.C_SLOT_5_MON_MODE FT \
  CONFIG.C_SLOT_5_TXN_CNTR_EN 1 \
  CONFIG.C_SLOT_6_AXI_ADDR_WIDTH 32 \
  CONFIG.C_SLOT_6_AXI_ARUSER_WIDTH 0 \
  CONFIG.C_SLOT_6_AXI_AR_SEL 1 \
  CONFIG.C_SLOT_6_AXI_AWUSER_WIDTH 0 \
  CONFIG.C_SLOT_6_AXI_AW_SEL 1 \
  CONFIG.C_SLOT_6_AXI_AXLEN_WIDTH 8 \
  CONFIG.C_SLOT_6_AXI_AXLOCK_WIDTH 1 \
  CONFIG.C_SLOT_6_AXI_BUSER_WIDTH 0 \
  CONFIG.C_SLOT_6_AXI_B_SEL 1 \
  CONFIG.C_SLOT_6_AXI_DATA_WIDTH 64 \
  CONFIG.C_SLOT_6_AXI_ID_WIDTH 0 \
  CONFIG.C_SLOT_6_AXI_PROTOCOL AXI4 \
  CONFIG.C_SLOT_6_AXI_RUSER_WIDTH 0 \
  CONFIG.C_SLOT_6_AXI_R_SEL 1 \
  CONFIG.C_SLOT_6_AXI_WUSER_WIDTH 0 \
  CONFIG.C_SLOT_6_AXI_W_SEL 1 \
  CONFIG.C_SLOT_6_HAS_BRESP 0 \
  CONFIG.C_SLOT_6_HAS_BURST 0 \
  CONFIG.C_SLOT_6_HAS_CACHE 1 \
  CONFIG.C_SLOT_6_HAS_LOCK 0 \
  CONFIG.C_SLOT_6_HAS_PROT 1 \
  CONFIG.C_SLOT_6_HAS_QOS 0 \
  CONFIG.C_SLOT_6_HAS_REGION 0 \
  CONFIG.C_SLOT_6_HAS_RRESP 1 \
  CONFIG.C_SLOT_6_HAS_WSTRB 0 \
  CONFIG.C_SLOT_6_MAX_RD_BURSTS 1 \
  CONFIG.C_SLOT_6_MAX_WR_BURSTS 1 \
  CONFIG.C_SLOT_6_MON_MODE FT \
  CONFIG.C_SLOT_6_TXN_CNTR_EN 1 \
  CONFIG.C_SLOT_7_AXI_ADDR_WIDTH 32 \
  CONFIG.C_SLOT_7_AXI_ARUSER_WIDTH 0 \
  CONFIG.C_SLOT_7_AXI_AR_SEL 1 \
  CONFIG.C_SLOT_7_AXI_AWUSER_WIDTH 0 \
  CONFIG.C_SLOT_7_AXI_AW_SEL 1 \
  CONFIG.C_SLOT_7_AXI_AXLEN_WIDTH 8 \
  CONFIG.C_SLOT_7_AXI_AXLOCK_WIDTH 1 \
  CONFIG.C_SLOT_7_AXI_BUSER_WIDTH 0 \
  CONFIG.C_SLOT_7_AXI_B_SEL 1 \
  CONFIG.C_SLOT_7_AXI_DATA_WIDTH 64 \
  CONFIG.C_SLOT_7_AXI_ID_WIDTH 0 \
  CONFIG.C_SLOT_7_AXI_PROTOCOL AXI4 \
  CONFIG.C_SLOT_7_AXI_RUSER_WIDTH 0 \
  CONFIG.C_SLOT_7_AXI_R_SEL 1 \
  CONFIG.C_SLOT_7_AXI_WUSER_WIDTH 0 \
  CONFIG.C_SLOT_7_AXI_W_SEL 1 \
  CONFIG.C_SLOT_7_HAS_BRESP 0 \
  CONFIG.C_SLOT_7_HAS_BURST 0 \
  CONFIG.C_SLOT_7_HAS_CACHE 1 \
  CONFIG.C_SLOT_7_HAS_LOCK 0 \
  CONFIG.C_SLOT_7_HAS_PROT 1 \
  CONFIG.C_SLOT_7_HAS_QOS 0 \
  CONFIG.C_SLOT_7_HAS_REGION 0 \
  CONFIG.C_SLOT_7_HAS_RRESP 1 \
  CONFIG.C_SLOT_7_HAS_WSTRB 0 \
  CONFIG.C_SLOT_7_MAX_RD_BURSTS 1 \
  CONFIG.C_SLOT_7_MAX_WR_BURSTS 1 \
  CONFIG.C_SLOT_7_MON_MODE FT \
  CONFIG.C_SLOT_7_TXN_CNTR_EN 1 \
  CONFIG.C_SLOT_8_AXIS_TDATA_WIDTH 24 \
  CONFIG.C_SLOT_8_AXIS_TDEST_WIDTH 1 \
  CONFIG.C_SLOT_8_AXIS_TID_WIDTH 1 \
  CONFIG.C_SLOT_8_AXIS_TUSER_WIDTH 1 \
  CONFIG.C_SLOT_8_AXI_PROTOCOL AXI4S \
  CONFIG.C_SLOT_8_HAS_TKEEP 1 \
  CONFIG.C_SLOT_8_HAS_TREADY 1 \
  CONFIG.C_SLOT_8_HAS_TSTRB 1 \
  CONFIG.C_SLOT_8_MON_MODE FT \
  CONFIG.C_SLOT_9_AXIS_TDATA_WIDTH 24 \
  CONFIG.C_SLOT_9_AXIS_TDEST_WIDTH 0 \
  CONFIG.C_SLOT_9_AXIS_TID_WIDTH 0 \
  CONFIG.C_SLOT_9_AXIS_TUSER_WIDTH 1 \
  CONFIG.C_SLOT_9_AXI_PROTOCOL AXI4S \
  CONFIG.C_SLOT_9_HAS_TKEEP 0 \
  CONFIG.C_SLOT_9_HAS_TREADY 1 \
  CONFIG.C_SLOT_9_HAS_TSTRB 0 \
  CONFIG.C_SLOT_9_MON_MODE FT \
] [get_bd_cells g_inst]
create_bd_cell -type ip -vlnv xilinx.com:ip:xlconcat:2.1 slot_0_aw
create_bd_cell -type ip -vlnv xilinx.com:ip:xlconcat:2.1 slot_0_w
set_property -dict {CONFIG.NUM_PORTS 3} [get_bd_cells slot_0_w]
create_bd_cell -type ip -vlnv xilinx.com:ip:xlconcat:2.1 slot_0_b
create_bd_cell -type ip -vlnv xilinx.com:ip:xlconcat:2.1 slot_0_ar
create_bd_cell -type ip -vlnv xilinx.com:ip:xlconcat:2.1 slot_0_r
set_property -dict {CONFIG.NUM_PORTS 3} [get_bd_cells slot_0_r]
create_bd_cell -type ip -vlnv xilinx.com:ip:xlconcat:2.1 slot_1_aw
create_bd_cell -type ip -vlnv xilinx.com:ip:xlconcat:2.1 slot_1_w
set_property -dict {CONFIG.NUM_PORTS 3} [get_bd_cells slot_1_w]
create_bd_cell -type ip -vlnv xilinx.com:ip:xlconcat:2.1 slot_1_b
create_bd_cell -type ip -vlnv xilinx.com:ip:xlconcat:2.1 slot_1_ar
create_bd_cell -type ip -vlnv xilinx.com:ip:xlconcat:2.1 slot_1_r
set_property -dict {CONFIG.NUM_PORTS 3} [get_bd_cells slot_1_r]
create_bd_cell -type ip -vlnv xilinx.com:ip:xlconcat:2.1 slot_3_aw
create_bd_cell -type ip -vlnv xilinx.com:ip:xlconcat:2.1 slot_3_w
set_property -dict {CONFIG.NUM_PORTS 3} [get_bd_cells slot_3_w]
create_bd_cell -type ip -vlnv xilinx.com:ip:xlconcat:2.1 slot_3_b
create_bd_cell -type ip -vlnv xilinx.com:ip:xlconcat:2.1 slot_3_ar
create_bd_cell -type ip -vlnv xilinx.com:ip:xlconcat:2.1 slot_3_r
set_property -dict {CONFIG.NUM_PORTS 3} [get_bd_cells slot_3_r]
create_bd_cell -type ip -vlnv xilinx.com:ip:xlconcat:2.1 slot_5_aw
create_bd_cell -type ip -vlnv xilinx.com:ip:xlconcat:2.1 slot_5_w
set_property -dict {CONFIG.NUM_PORTS 3} [get_bd_cells slot_5_w]
create_bd_cell -type ip -vlnv xilinx.com:ip:xlconcat:2.1 slot_5_b
create_bd_cell -type ip -vlnv xilinx.com:ip:xlconcat:2.1 slot_5_ar
create_bd_cell -type ip -vlnv xilinx.com:ip:xlconcat:2.1 slot_5_r
set_property -dict {CONFIG.NUM_PORTS 3} [get_bd_cells slot_5_r]
create_bd_cell -type ip -vlnv xilinx.com:ip:xlconcat:2.1 slot_6_aw
create_bd_cell -type ip -vlnv xilinx.com:ip:xlconcat:2.1 slot_6_w
set_property -dict {CONFIG.NUM_PORTS 3} [get_bd_cells slot_6_w]
create_bd_cell -type ip -vlnv xilinx.com:ip:xlconcat:2.1 slot_6_b
create_bd_cell -type ip -vlnv xilinx.com:ip:xlconcat:2.1 slot_6_ar
create_bd_cell -type ip -vlnv xilinx.com:ip:xlconcat:2.1 slot_6_r
set_property -dict {CONFIG.NUM_PORTS 3} [get_bd_cells slot_6_r]
create_bd_cell -type ip -vlnv xilinx.com:ip:xlconcat:2.1 slot_7_aw
create_bd_cell -type ip -vlnv xilinx.com:ip:xlconcat:2.1 slot_7_w
set_property -dict {CONFIG.NUM_PORTS 3} [get_bd_cells slot_7_w]
create_bd_cell -type ip -vlnv xilinx.com:ip:xlconcat:2.1 slot_7_b
create_bd_cell -type ip -vlnv xilinx.com:ip:xlconcat:2.1 slot_7_ar
create_bd_cell -type ip -vlnv xilinx.com:ip:xlconcat:2.1 slot_7_r
set_property -dict {CONFIG.NUM_PORTS 3} [get_bd_cells slot_7_r]

# ---- connections ----

connect_bd_intf_net [get_bd_intf_ports SLOT_0_AXI] [get_bd_intf_pins g_inst/slot_0_axi]
connect_bd_intf_net [get_bd_intf_ports SLOT_2_AXIS] [get_bd_intf_pins g_inst/slot_2_axis]
connect_bd_intf_net [get_bd_intf_ports SLOT_1_AXI] [get_bd_intf_pins g_inst/slot_1_axi]
connect_bd_intf_net [get_bd_intf_ports SLOT_4_AXIS] [get_bd_intf_pins g_inst/slot_4_axis]
connect_bd_intf_net [get_bd_intf_ports SLOT_3_AXI] [get_bd_intf_pins g_inst/slot_3_axi]
connect_bd_intf_net [get_bd_intf_ports SLOT_5_AXI] [get_bd_intf_pins g_inst/slot_5_axi]
connect_bd_intf_net [get_bd_intf_ports SLOT_6_AXI] [get_bd_intf_pins g_inst/slot_6_axi]
connect_bd_intf_net [get_bd_intf_ports SLOT_9_AXIS] [get_bd_intf_pins g_inst/slot_9_axis]
connect_bd_intf_net [get_bd_intf_ports SLOT_7_AXI] [get_bd_intf_pins g_inst/slot_7_axi]
connect_bd_intf_net [get_bd_intf_ports SLOT_10_AXIS] [get_bd_intf_pins g_inst/slot_10_axis]
connect_bd_intf_net [get_bd_intf_ports SLOT_8_AXIS] [get_bd_intf_pins g_inst/slot_8_axis]
connect_bd_net [get_bd_ports clk] [get_bd_pins ila_lib/clk] [get_bd_pins g_inst/aclk]
connect_bd_net -net probe0_1 [get_bd_ports probe0] [get_bd_pins ila_lib/probe0]
connect_bd_net -net probe1_1 [get_bd_ports probe1] [get_bd_pins ila_lib/probe1]
connect_bd_net [get_bd_ports resetn] [get_bd_pins g_inst/aresetn]
connect_bd_net -net net_slot_0_axi_ar_cnt [get_bd_pins g_inst/m_slot_0_axi_ar_cnt] [get_bd_pins ila_lib/probe2]
connect_bd_net -net net_slot_0_axi_araddr [get_bd_pins g_inst/m_slot_0_axi_araddr] [get_bd_pins ila_lib/probe3]
connect_bd_net -net net_slot_0_axi_arcache [get_bd_pins g_inst/m_slot_0_axi_arcache] [get_bd_pins ila_lib/probe4]
connect_bd_net -net net_slot_0_axi_arid [get_bd_pins g_inst/m_slot_0_axi_arid] [get_bd_pins ila_lib/probe5]
connect_bd_net -net net_slot_0_axi_arlen [get_bd_pins g_inst/m_slot_0_axi_arlen] [get_bd_pins ila_lib/probe6]
connect_bd_net -net net_slot_0_axi_arprot [get_bd_pins g_inst/m_slot_0_axi_arprot] [get_bd_pins ila_lib/probe7]
connect_bd_net -net net_slot_0_axi_arsize [get_bd_pins g_inst/m_slot_0_axi_arsize] [get_bd_pins ila_lib/probe8]
connect_bd_net -net net_slot_0_axi_aw_cnt [get_bd_pins g_inst/m_slot_0_axi_aw_cnt] [get_bd_pins ila_lib/probe9]
connect_bd_net -net net_slot_0_axi_awaddr [get_bd_pins g_inst/m_slot_0_axi_awaddr] [get_bd_pins ila_lib/probe10]
connect_bd_net -net net_slot_0_axi_awcache [get_bd_pins g_inst/m_slot_0_axi_awcache] [get_bd_pins ila_lib/probe11]
connect_bd_net -net net_slot_0_axi_awid [get_bd_pins g_inst/m_slot_0_axi_awid] [get_bd_pins ila_lib/probe12]
connect_bd_net -net net_slot_0_axi_awlen [get_bd_pins g_inst/m_slot_0_axi_awlen] [get_bd_pins ila_lib/probe13]
connect_bd_net -net net_slot_0_axi_awprot [get_bd_pins g_inst/m_slot_0_axi_awprot] [get_bd_pins ila_lib/probe14]
connect_bd_net -net net_slot_0_axi_awsize [get_bd_pins g_inst/m_slot_0_axi_awsize] [get_bd_pins ila_lib/probe15]
connect_bd_net -net net_slot_0_axi_b_cnt [get_bd_pins g_inst/m_slot_0_axi_b_cnt] [get_bd_pins ila_lib/probe16]
connect_bd_net -net net_slot_0_axi_bid [get_bd_pins g_inst/m_slot_0_axi_bid] [get_bd_pins ila_lib/probe17]
connect_bd_net -net net_slot_0_axi_bresp [get_bd_pins g_inst/m_slot_0_axi_bresp] [get_bd_pins ila_lib/probe18]
connect_bd_net -net net_slot_0_axi_r_cnt [get_bd_pins g_inst/m_slot_0_axi_r_cnt] [get_bd_pins ila_lib/probe19]
connect_bd_net -net net_slot_0_axi_rdata [get_bd_pins g_inst/m_slot_0_axi_rdata] [get_bd_pins ila_lib/probe20]
connect_bd_net -net net_slot_0_axi_rid [get_bd_pins g_inst/m_slot_0_axi_rid] [get_bd_pins ila_lib/probe21]
connect_bd_net -net net_slot_0_axi_rresp [get_bd_pins g_inst/m_slot_0_axi_rresp] [get_bd_pins ila_lib/probe22]
connect_bd_net -net net_slot_0_axi_wdata [get_bd_pins g_inst/m_slot_0_axi_wdata] [get_bd_pins ila_lib/probe23]
connect_bd_net -net net_slot_0_axi_wid [get_bd_pins g_inst/m_slot_0_axi_wid] [get_bd_pins ila_lib/probe24]
connect_bd_net -net net_slot_0_axi_wstrb [get_bd_pins g_inst/m_slot_0_axi_wstrb] [get_bd_pins ila_lib/probe25]
connect_bd_net -net net_slot_0_axi_aw_ctrl [get_bd_pins slot_0_aw/dout] [get_bd_pins ila_lib/probe26]
connect_bd_net -net net_slot_0_axi_awvalid [get_bd_pins g_inst/m_slot_0_axi_awvalid] [get_bd_pins slot_0_aw/In0]
connect_bd_net -net net_slot_0_axi_awready [get_bd_pins g_inst/m_slot_0_axi_awready] [get_bd_pins slot_0_aw/In1]
connect_bd_net -net net_slot_0_axi_w_ctrl [get_bd_pins slot_0_w/dout] [get_bd_pins ila_lib/probe27]
connect_bd_net -net net_slot_0_axi_wvalid [get_bd_pins g_inst/m_slot_0_axi_wvalid] [get_bd_pins slot_0_w/In0]
connect_bd_net -net net_slot_0_axi_wready [get_bd_pins g_inst/m_slot_0_axi_wready] [get_bd_pins slot_0_w/In1]
connect_bd_net -net net_slot_0_axi_wlast [get_bd_pins g_inst/m_slot_0_axi_wlast] [get_bd_pins slot_0_w/In2]
connect_bd_net -net net_slot_0_axi_b_ctrl [get_bd_pins slot_0_b/dout] [get_bd_pins ila_lib/probe28]
connect_bd_net -net net_slot_0_axi_bvalid [get_bd_pins g_inst/m_slot_0_axi_bvalid] [get_bd_pins slot_0_b/In0]
connect_bd_net -net net_slot_0_axi_bready [get_bd_pins g_inst/m_slot_0_axi_bready] [get_bd_pins slot_0_b/In1]
connect_bd_net -net net_slot_0_axi_ar_ctrl [get_bd_pins slot_0_ar/dout] [get_bd_pins ila_lib/probe29]
connect_bd_net -net net_slot_0_axi_arvalid [get_bd_pins g_inst/m_slot_0_axi_arvalid] [get_bd_pins slot_0_ar/In0]
connect_bd_net -net net_slot_0_axi_arready [get_bd_pins g_inst/m_slot_0_axi_arready] [get_bd_pins slot_0_ar/In1]
connect_bd_net -net net_slot_0_axi_r_ctrl [get_bd_pins slot_0_r/dout] [get_bd_pins ila_lib/probe30]
connect_bd_net -net net_slot_0_axi_rvalid [get_bd_pins g_inst/m_slot_0_axi_rvalid] [get_bd_pins slot_0_r/In0]
connect_bd_net -net net_slot_0_axi_rready [get_bd_pins g_inst/m_slot_0_axi_rready] [get_bd_pins slot_0_r/In1]
connect_bd_net -net net_slot_0_axi_rlast [get_bd_pins g_inst/m_slot_0_axi_rlast] [get_bd_pins slot_0_r/In2]
connect_bd_net -net net_slot_1_axi_ar_cnt [get_bd_pins g_inst/m_slot_1_axi_ar_cnt] [get_bd_pins ila_lib/probe31]
connect_bd_net -net net_slot_1_axi_araddr [get_bd_pins g_inst/m_slot_1_axi_araddr] [get_bd_pins ila_lib/probe32]
connect_bd_net -net net_slot_1_axi_arcache [get_bd_pins g_inst/m_slot_1_axi_arcache] [get_bd_pins ila_lib/probe33]
connect_bd_net -net net_slot_1_axi_arid [get_bd_pins g_inst/m_slot_1_axi_arid] [get_bd_pins ila_lib/probe34]
connect_bd_net -net net_slot_1_axi_arlen [get_bd_pins g_inst/m_slot_1_axi_arlen] [get_bd_pins ila_lib/probe35]
connect_bd_net -net net_slot_1_axi_arprot [get_bd_pins g_inst/m_slot_1_axi_arprot] [get_bd_pins ila_lib/probe36]
connect_bd_net -net net_slot_1_axi_arsize [get_bd_pins g_inst/m_slot_1_axi_arsize] [get_bd_pins ila_lib/probe37]
connect_bd_net -net net_slot_1_axi_aw_cnt [get_bd_pins g_inst/m_slot_1_axi_aw_cnt] [get_bd_pins ila_lib/probe38]
connect_bd_net -net net_slot_1_axi_awaddr [get_bd_pins g_inst/m_slot_1_axi_awaddr] [get_bd_pins ila_lib/probe39]
connect_bd_net -net net_slot_1_axi_awcache [get_bd_pins g_inst/m_slot_1_axi_awcache] [get_bd_pins ila_lib/probe40]
connect_bd_net -net net_slot_1_axi_awid [get_bd_pins g_inst/m_slot_1_axi_awid] [get_bd_pins ila_lib/probe41]
connect_bd_net -net net_slot_1_axi_awlen [get_bd_pins g_inst/m_slot_1_axi_awlen] [get_bd_pins ila_lib/probe42]
connect_bd_net -net net_slot_1_axi_awprot [get_bd_pins g_inst/m_slot_1_axi_awprot] [get_bd_pins ila_lib/probe43]
connect_bd_net -net net_slot_1_axi_awsize [get_bd_pins g_inst/m_slot_1_axi_awsize] [get_bd_pins ila_lib/probe44]
connect_bd_net -net net_slot_1_axi_b_cnt [get_bd_pins g_inst/m_slot_1_axi_b_cnt] [get_bd_pins ila_lib/probe45]
connect_bd_net -net net_slot_1_axi_bid [get_bd_pins g_inst/m_slot_1_axi_bid] [get_bd_pins ila_lib/probe46]
connect_bd_net -net net_slot_1_axi_bresp [get_bd_pins g_inst/m_slot_1_axi_bresp] [get_bd_pins ila_lib/probe47]
connect_bd_net -net net_slot_1_axi_r_cnt [get_bd_pins g_inst/m_slot_1_axi_r_cnt] [get_bd_pins ila_lib/probe48]
connect_bd_net -net net_slot_1_axi_rdata [get_bd_pins g_inst/m_slot_1_axi_rdata] [get_bd_pins ila_lib/probe49]
connect_bd_net -net net_slot_1_axi_rid [get_bd_pins g_inst/m_slot_1_axi_rid] [get_bd_pins ila_lib/probe50]
connect_bd_net -net net_slot_1_axi_rresp [get_bd_pins g_inst/m_slot_1_axi_rresp] [get_bd_pins ila_lib/probe51]
connect_bd_net -net net_slot_1_axi_wdata [get_bd_pins g_inst/m_slot_1_axi_wdata] [get_bd_pins ila_lib/probe52]
connect_bd_net -net net_slot_1_axi_wid [get_bd_pins g_inst/m_slot_1_axi_wid] [get_bd_pins ila_lib/probe53]
connect_bd_net -net net_slot_1_axi_wstrb [get_bd_pins g_inst/m_slot_1_axi_wstrb] [get_bd_pins ila_lib/probe54]
connect_bd_net -net net_slot_1_axi_aw_ctrl [get_bd_pins slot_1_aw/dout] [get_bd_pins ila_lib/probe55]
connect_bd_net -net net_slot_1_axi_awvalid [get_bd_pins g_inst/m_slot_1_axi_awvalid] [get_bd_pins slot_1_aw/In0]
connect_bd_net -net net_slot_1_axi_awready [get_bd_pins g_inst/m_slot_1_axi_awready] [get_bd_pins slot_1_aw/In1]
connect_bd_net -net net_slot_1_axi_w_ctrl [get_bd_pins slot_1_w/dout] [get_bd_pins ila_lib/probe56]
connect_bd_net -net net_slot_1_axi_wvalid [get_bd_pins g_inst/m_slot_1_axi_wvalid] [get_bd_pins slot_1_w/In0]
connect_bd_net -net net_slot_1_axi_wready [get_bd_pins g_inst/m_slot_1_axi_wready] [get_bd_pins slot_1_w/In1]
connect_bd_net -net net_slot_1_axi_wlast [get_bd_pins g_inst/m_slot_1_axi_wlast] [get_bd_pins slot_1_w/In2]
connect_bd_net -net net_slot_1_axi_b_ctrl [get_bd_pins slot_1_b/dout] [get_bd_pins ila_lib/probe57]
connect_bd_net -net net_slot_1_axi_bvalid [get_bd_pins g_inst/m_slot_1_axi_bvalid] [get_bd_pins slot_1_b/In0]
connect_bd_net -net net_slot_1_axi_bready [get_bd_pins g_inst/m_slot_1_axi_bready] [get_bd_pins slot_1_b/In1]
connect_bd_net -net net_slot_1_axi_ar_ctrl [get_bd_pins slot_1_ar/dout] [get_bd_pins ila_lib/probe58]
connect_bd_net -net net_slot_1_axi_arvalid [get_bd_pins g_inst/m_slot_1_axi_arvalid] [get_bd_pins slot_1_ar/In0]
connect_bd_net -net net_slot_1_axi_arready [get_bd_pins g_inst/m_slot_1_axi_arready] [get_bd_pins slot_1_ar/In1]
connect_bd_net -net net_slot_1_axi_r_ctrl [get_bd_pins slot_1_r/dout] [get_bd_pins ila_lib/probe59]
connect_bd_net -net net_slot_1_axi_rvalid [get_bd_pins g_inst/m_slot_1_axi_rvalid] [get_bd_pins slot_1_r/In0]
connect_bd_net -net net_slot_1_axi_rready [get_bd_pins g_inst/m_slot_1_axi_rready] [get_bd_pins slot_1_r/In1]
connect_bd_net -net net_slot_1_axi_rlast [get_bd_pins g_inst/m_slot_1_axi_rlast] [get_bd_pins slot_1_r/In2]
connect_bd_net -net net_slot_2_axis_tdata [get_bd_pins g_inst/m_slot_2_axis_tdata] [get_bd_pins ila_lib/probe60]
connect_bd_net -net net_slot_2_axis_tkeep [get_bd_pins g_inst/m_slot_2_axis_tkeep] [get_bd_pins ila_lib/probe61]
connect_bd_net -net net_slot_2_axis_tuser [get_bd_pins g_inst/m_slot_2_axis_tuser] [get_bd_pins ila_lib/probe62]
connect_bd_net -net net_slot_2_axis_tvalid [get_bd_pins g_inst/m_slot_2_axis_tvalid] [get_bd_pins ila_lib/probe63]
connect_bd_net -net net_slot_2_axis_tready [get_bd_pins g_inst/m_slot_2_axis_tready] [get_bd_pins ila_lib/probe64]
connect_bd_net -net net_slot_2_axis_tlast [get_bd_pins g_inst/m_slot_2_axis_tlast] [get_bd_pins ila_lib/probe65]
connect_bd_net -net net_slot_3_axi_ar_cnt [get_bd_pins g_inst/m_slot_3_axi_ar_cnt] [get_bd_pins ila_lib/probe66]
connect_bd_net -net net_slot_3_axi_araddr [get_bd_pins g_inst/m_slot_3_axi_araddr] [get_bd_pins ila_lib/probe67]
connect_bd_net -net net_slot_3_axi_arcache [get_bd_pins g_inst/m_slot_3_axi_arcache] [get_bd_pins ila_lib/probe68]
connect_bd_net -net net_slot_3_axi_arlen [get_bd_pins g_inst/m_slot_3_axi_arlen] [get_bd_pins ila_lib/probe69]
connect_bd_net -net net_slot_3_axi_arprot [get_bd_pins g_inst/m_slot_3_axi_arprot] [get_bd_pins ila_lib/probe70]
connect_bd_net -net net_slot_3_axi_arsize [get_bd_pins g_inst/m_slot_3_axi_arsize] [get_bd_pins ila_lib/probe71]
connect_bd_net -net net_slot_3_axi_aw_cnt [get_bd_pins g_inst/m_slot_3_axi_aw_cnt] [get_bd_pins ila_lib/probe72]
connect_bd_net -net net_slot_3_axi_awaddr [get_bd_pins g_inst/m_slot_3_axi_awaddr] [get_bd_pins ila_lib/probe73]
connect_bd_net -net net_slot_3_axi_awcache [get_bd_pins g_inst/m_slot_3_axi_awcache] [get_bd_pins ila_lib/probe74]
connect_bd_net -net net_slot_3_axi_awlen [get_bd_pins g_inst/m_slot_3_axi_awlen] [get_bd_pins ila_lib/probe75]
connect_bd_net -net net_slot_3_axi_awprot [get_bd_pins g_inst/m_slot_3_axi_awprot] [get_bd_pins ila_lib/probe76]
connect_bd_net -net net_slot_3_axi_awsize [get_bd_pins g_inst/m_slot_3_axi_awsize] [get_bd_pins ila_lib/probe77]
connect_bd_net -net net_slot_3_axi_b_cnt [get_bd_pins g_inst/m_slot_3_axi_b_cnt] [get_bd_pins ila_lib/probe78]
connect_bd_net -net net_slot_3_axi_bresp [get_bd_pins g_inst/m_slot_3_axi_bresp] [get_bd_pins ila_lib/probe79]
connect_bd_net -net net_slot_3_axi_r_cnt [get_bd_pins g_inst/m_slot_3_axi_r_cnt] [get_bd_pins ila_lib/probe80]
connect_bd_net -net net_slot_3_axi_rdata [get_bd_pins g_inst/m_slot_3_axi_rdata] [get_bd_pins ila_lib/probe81]
connect_bd_net -net net_slot_3_axi_wdata [get_bd_pins g_inst/m_slot_3_axi_wdata] [get_bd_pins ila_lib/probe82]
connect_bd_net -net net_slot_3_axi_wstrb [get_bd_pins g_inst/m_slot_3_axi_wstrb] [get_bd_pins ila_lib/probe83]
connect_bd_net -net net_slot_3_axi_aw_ctrl [get_bd_pins slot_3_aw/dout] [get_bd_pins ila_lib/probe84]
connect_bd_net -net net_slot_3_axi_awvalid [get_bd_pins g_inst/m_slot_3_axi_awvalid] [get_bd_pins slot_3_aw/In0]
connect_bd_net -net net_slot_3_axi_awready [get_bd_pins g_inst/m_slot_3_axi_awready] [get_bd_pins slot_3_aw/In1]
connect_bd_net -net net_slot_3_axi_w_ctrl [get_bd_pins slot_3_w/dout] [get_bd_pins ila_lib/probe85]
connect_bd_net -net net_slot_3_axi_wvalid [get_bd_pins g_inst/m_slot_3_axi_wvalid] [get_bd_pins slot_3_w/In0]
connect_bd_net -net net_slot_3_axi_wready [get_bd_pins g_inst/m_slot_3_axi_wready] [get_bd_pins slot_3_w/In1]
connect_bd_net -net net_slot_3_axi_wlast [get_bd_pins g_inst/m_slot_3_axi_wlast] [get_bd_pins slot_3_w/In2]
connect_bd_net -net net_slot_3_axi_b_ctrl [get_bd_pins slot_3_b/dout] [get_bd_pins ila_lib/probe86]
connect_bd_net -net net_slot_3_axi_bvalid [get_bd_pins g_inst/m_slot_3_axi_bvalid] [get_bd_pins slot_3_b/In0]
connect_bd_net -net net_slot_3_axi_bready [get_bd_pins g_inst/m_slot_3_axi_bready] [get_bd_pins slot_3_b/In1]
connect_bd_net -net net_slot_3_axi_ar_ctrl [get_bd_pins slot_3_ar/dout] [get_bd_pins ila_lib/probe87]
connect_bd_net -net net_slot_3_axi_arvalid [get_bd_pins g_inst/m_slot_3_axi_arvalid] [get_bd_pins slot_3_ar/In0]
connect_bd_net -net net_slot_3_axi_arready [get_bd_pins g_inst/m_slot_3_axi_arready] [get_bd_pins slot_3_ar/In1]
connect_bd_net -net net_slot_3_axi_r_ctrl [get_bd_pins slot_3_r/dout] [get_bd_pins ila_lib/probe88]
connect_bd_net -net net_slot_3_axi_rvalid [get_bd_pins g_inst/m_slot_3_axi_rvalid] [get_bd_pins slot_3_r/In0]
connect_bd_net -net net_slot_3_axi_rready [get_bd_pins g_inst/m_slot_3_axi_rready] [get_bd_pins slot_3_r/In1]
connect_bd_net -net net_slot_3_axi_rlast [get_bd_pins g_inst/m_slot_3_axi_rlast] [get_bd_pins slot_3_r/In2]
connect_bd_net -net net_slot_4_axis_tdata [get_bd_pins g_inst/m_slot_4_axis_tdata] [get_bd_pins ila_lib/probe89]
connect_bd_net -net net_slot_4_axis_tkeep [get_bd_pins g_inst/m_slot_4_axis_tkeep] [get_bd_pins ila_lib/probe90]
connect_bd_net -net net_slot_4_axis_tuser [get_bd_pins g_inst/m_slot_4_axis_tuser] [get_bd_pins ila_lib/probe91]
connect_bd_net -net net_slot_4_axis_tvalid [get_bd_pins g_inst/m_slot_4_axis_tvalid] [get_bd_pins ila_lib/probe92]
connect_bd_net -net net_slot_4_axis_tready [get_bd_pins g_inst/m_slot_4_axis_tready] [get_bd_pins ila_lib/probe93]
connect_bd_net -net net_slot_4_axis_tlast [get_bd_pins g_inst/m_slot_4_axis_tlast] [get_bd_pins ila_lib/probe94]
connect_bd_net -net net_slot_5_axi_ar_cnt [get_bd_pins g_inst/m_slot_5_axi_ar_cnt] [get_bd_pins ila_lib/probe95]
connect_bd_net -net net_slot_5_axi_araddr [get_bd_pins g_inst/m_slot_5_axi_araddr] [get_bd_pins ila_lib/probe96]
connect_bd_net -net net_slot_5_axi_arcache [get_bd_pins g_inst/m_slot_5_axi_arcache] [get_bd_pins ila_lib/probe97]
connect_bd_net -net net_slot_5_axi_arlen [get_bd_pins g_inst/m_slot_5_axi_arlen] [get_bd_pins ila_lib/probe98]
connect_bd_net -net net_slot_5_axi_arprot [get_bd_pins g_inst/m_slot_5_axi_arprot] [get_bd_pins ila_lib/probe99]
connect_bd_net -net net_slot_5_axi_arsize [get_bd_pins g_inst/m_slot_5_axi_arsize] [get_bd_pins ila_lib/probe100]
connect_bd_net -net net_slot_5_axi_aw_cnt [get_bd_pins g_inst/m_slot_5_axi_aw_cnt] [get_bd_pins ila_lib/probe101]
connect_bd_net -net net_slot_5_axi_awaddr [get_bd_pins g_inst/m_slot_5_axi_awaddr] [get_bd_pins ila_lib/probe102]
connect_bd_net -net net_slot_5_axi_awcache [get_bd_pins g_inst/m_slot_5_axi_awcache] [get_bd_pins ila_lib/probe103]
connect_bd_net -net net_slot_5_axi_awlen [get_bd_pins g_inst/m_slot_5_axi_awlen] [get_bd_pins ila_lib/probe104]
connect_bd_net -net net_slot_5_axi_awprot [get_bd_pins g_inst/m_slot_5_axi_awprot] [get_bd_pins ila_lib/probe105]
connect_bd_net -net net_slot_5_axi_awsize [get_bd_pins g_inst/m_slot_5_axi_awsize] [get_bd_pins ila_lib/probe106]
connect_bd_net -net net_slot_5_axi_b_cnt [get_bd_pins g_inst/m_slot_5_axi_b_cnt] [get_bd_pins ila_lib/probe107]
connect_bd_net -net net_slot_5_axi_bresp [get_bd_pins g_inst/m_slot_5_axi_bresp] [get_bd_pins ila_lib/probe108]
connect_bd_net -net net_slot_5_axi_r_cnt [get_bd_pins g_inst/m_slot_5_axi_r_cnt] [get_bd_pins ila_lib/probe109]
connect_bd_net -net net_slot_5_axi_rdata [get_bd_pins g_inst/m_slot_5_axi_rdata] [get_bd_pins ila_lib/probe110]
connect_bd_net -net net_slot_5_axi_wdata [get_bd_pins g_inst/m_slot_5_axi_wdata] [get_bd_pins ila_lib/probe111]
connect_bd_net -net net_slot_5_axi_wstrb [get_bd_pins g_inst/m_slot_5_axi_wstrb] [get_bd_pins ila_lib/probe112]
connect_bd_net -net net_slot_5_axi_aw_ctrl [get_bd_pins slot_5_aw/dout] [get_bd_pins ila_lib/probe113]
connect_bd_net -net net_slot_5_axi_awvalid [get_bd_pins g_inst/m_slot_5_axi_awvalid] [get_bd_pins slot_5_aw/In0]
connect_bd_net -net net_slot_5_axi_awready [get_bd_pins g_inst/m_slot_5_axi_awready] [get_bd_pins slot_5_aw/In1]
connect_bd_net -net net_slot_5_axi_w_ctrl [get_bd_pins slot_5_w/dout] [get_bd_pins ila_lib/probe114]
connect_bd_net -net net_slot_5_axi_wvalid [get_bd_pins g_inst/m_slot_5_axi_wvalid] [get_bd_pins slot_5_w/In0]
connect_bd_net -net net_slot_5_axi_wready [get_bd_pins g_inst/m_slot_5_axi_wready] [get_bd_pins slot_5_w/In1]
connect_bd_net -net net_slot_5_axi_wlast [get_bd_pins g_inst/m_slot_5_axi_wlast] [get_bd_pins slot_5_w/In2]
connect_bd_net -net net_slot_5_axi_b_ctrl [get_bd_pins slot_5_b/dout] [get_bd_pins ila_lib/probe115]
connect_bd_net -net net_slot_5_axi_bvalid [get_bd_pins g_inst/m_slot_5_axi_bvalid] [get_bd_pins slot_5_b/In0]
connect_bd_net -net net_slot_5_axi_bready [get_bd_pins g_inst/m_slot_5_axi_bready] [get_bd_pins slot_5_b/In1]
connect_bd_net -net net_slot_5_axi_ar_ctrl [get_bd_pins slot_5_ar/dout] [get_bd_pins ila_lib/probe116]
connect_bd_net -net net_slot_5_axi_arvalid [get_bd_pins g_inst/m_slot_5_axi_arvalid] [get_bd_pins slot_5_ar/In0]
connect_bd_net -net net_slot_5_axi_arready [get_bd_pins g_inst/m_slot_5_axi_arready] [get_bd_pins slot_5_ar/In1]
connect_bd_net -net net_slot_5_axi_r_ctrl [get_bd_pins slot_5_r/dout] [get_bd_pins ila_lib/probe117]
connect_bd_net -net net_slot_5_axi_rvalid [get_bd_pins g_inst/m_slot_5_axi_rvalid] [get_bd_pins slot_5_r/In0]
connect_bd_net -net net_slot_5_axi_rready [get_bd_pins g_inst/m_slot_5_axi_rready] [get_bd_pins slot_5_r/In1]
connect_bd_net -net net_slot_5_axi_rlast [get_bd_pins g_inst/m_slot_5_axi_rlast] [get_bd_pins slot_5_r/In2]
connect_bd_net -net net_slot_6_axi_ar_cnt [get_bd_pins g_inst/m_slot_6_axi_ar_cnt] [get_bd_pins ila_lib/probe118]
connect_bd_net -net net_slot_6_axi_araddr [get_bd_pins g_inst/m_slot_6_axi_araddr] [get_bd_pins ila_lib/probe119]
connect_bd_net -net net_slot_6_axi_arcache [get_bd_pins g_inst/m_slot_6_axi_arcache] [get_bd_pins ila_lib/probe120]
connect_bd_net -net net_slot_6_axi_arlen [get_bd_pins g_inst/m_slot_6_axi_arlen] [get_bd_pins ila_lib/probe121]
connect_bd_net -net net_slot_6_axi_arprot [get_bd_pins g_inst/m_slot_6_axi_arprot] [get_bd_pins ila_lib/probe122]
connect_bd_net -net net_slot_6_axi_arsize [get_bd_pins g_inst/m_slot_6_axi_arsize] [get_bd_pins ila_lib/probe123]
connect_bd_net -net net_slot_6_axi_aw_cnt [get_bd_pins g_inst/m_slot_6_axi_aw_cnt] [get_bd_pins ila_lib/probe124]
connect_bd_net -net net_slot_6_axi_awaddr [get_bd_pins g_inst/m_slot_6_axi_awaddr] [get_bd_pins ila_lib/probe125]
connect_bd_net -net net_slot_6_axi_awcache [get_bd_pins g_inst/m_slot_6_axi_awcache] [get_bd_pins ila_lib/probe126]
connect_bd_net -net net_slot_6_axi_awlen [get_bd_pins g_inst/m_slot_6_axi_awlen] [get_bd_pins ila_lib/probe127]
connect_bd_net -net net_slot_6_axi_awprot [get_bd_pins g_inst/m_slot_6_axi_awprot] [get_bd_pins ila_lib/probe128]
connect_bd_net -net net_slot_6_axi_awsize [get_bd_pins g_inst/m_slot_6_axi_awsize] [get_bd_pins ila_lib/probe129]
connect_bd_net -net net_slot_6_axi_b_cnt [get_bd_pins g_inst/m_slot_6_axi_b_cnt] [get_bd_pins ila_lib/probe130]
connect_bd_net -net net_slot_6_axi_r_cnt [get_bd_pins g_inst/m_slot_6_axi_r_cnt] [get_bd_pins ila_lib/probe131]
connect_bd_net -net net_slot_6_axi_rdata [get_bd_pins g_inst/m_slot_6_axi_rdata] [get_bd_pins ila_lib/probe132]
connect_bd_net -net net_slot_6_axi_rresp [get_bd_pins g_inst/m_slot_6_axi_rresp] [get_bd_pins ila_lib/probe133]
connect_bd_net -net net_slot_6_axi_wdata [get_bd_pins g_inst/m_slot_6_axi_wdata] [get_bd_pins ila_lib/probe134]
connect_bd_net -net net_slot_6_axi_aw_ctrl [get_bd_pins slot_6_aw/dout] [get_bd_pins ila_lib/probe135]
connect_bd_net -net net_slot_6_axi_awvalid [get_bd_pins g_inst/m_slot_6_axi_awvalid] [get_bd_pins slot_6_aw/In0]
connect_bd_net -net net_slot_6_axi_awready [get_bd_pins g_inst/m_slot_6_axi_awready] [get_bd_pins slot_6_aw/In1]
connect_bd_net -net net_slot_6_axi_w_ctrl [get_bd_pins slot_6_w/dout] [get_bd_pins ila_lib/probe136]
connect_bd_net -net net_slot_6_axi_wvalid [get_bd_pins g_inst/m_slot_6_axi_wvalid] [get_bd_pins slot_6_w/In0]
connect_bd_net -net net_slot_6_axi_wready [get_bd_pins g_inst/m_slot_6_axi_wready] [get_bd_pins slot_6_w/In1]
connect_bd_net -net net_slot_6_axi_wlast [get_bd_pins g_inst/m_slot_6_axi_wlast] [get_bd_pins slot_6_w/In2]
connect_bd_net -net net_slot_6_axi_b_ctrl [get_bd_pins slot_6_b/dout] [get_bd_pins ila_lib/probe137]
connect_bd_net -net net_slot_6_axi_bvalid [get_bd_pins g_inst/m_slot_6_axi_bvalid] [get_bd_pins slot_6_b/In0]
connect_bd_net -net net_slot_6_axi_bready [get_bd_pins g_inst/m_slot_6_axi_bready] [get_bd_pins slot_6_b/In1]
connect_bd_net -net net_slot_6_axi_ar_ctrl [get_bd_pins slot_6_ar/dout] [get_bd_pins ila_lib/probe138]
connect_bd_net -net net_slot_6_axi_arvalid [get_bd_pins g_inst/m_slot_6_axi_arvalid] [get_bd_pins slot_6_ar/In0]
connect_bd_net -net net_slot_6_axi_arready [get_bd_pins g_inst/m_slot_6_axi_arready] [get_bd_pins slot_6_ar/In1]
connect_bd_net -net net_slot_6_axi_r_ctrl [get_bd_pins slot_6_r/dout] [get_bd_pins ila_lib/probe139]
connect_bd_net -net net_slot_6_axi_rvalid [get_bd_pins g_inst/m_slot_6_axi_rvalid] [get_bd_pins slot_6_r/In0]
connect_bd_net -net net_slot_6_axi_rready [get_bd_pins g_inst/m_slot_6_axi_rready] [get_bd_pins slot_6_r/In1]
connect_bd_net -net net_slot_6_axi_rlast [get_bd_pins g_inst/m_slot_6_axi_rlast] [get_bd_pins slot_6_r/In2]
connect_bd_net -net net_slot_7_axi_ar_cnt [get_bd_pins g_inst/m_slot_7_axi_ar_cnt] [get_bd_pins ila_lib/probe140]
connect_bd_net -net net_slot_7_axi_araddr [get_bd_pins g_inst/m_slot_7_axi_araddr] [get_bd_pins ila_lib/probe141]
connect_bd_net -net net_slot_7_axi_arcache [get_bd_pins g_inst/m_slot_7_axi_arcache] [get_bd_pins ila_lib/probe142]
connect_bd_net -net net_slot_7_axi_arlen [get_bd_pins g_inst/m_slot_7_axi_arlen] [get_bd_pins ila_lib/probe143]
connect_bd_net -net net_slot_7_axi_arprot [get_bd_pins g_inst/m_slot_7_axi_arprot] [get_bd_pins ila_lib/probe144]
connect_bd_net -net net_slot_7_axi_arsize [get_bd_pins g_inst/m_slot_7_axi_arsize] [get_bd_pins ila_lib/probe145]
connect_bd_net -net net_slot_7_axi_aw_cnt [get_bd_pins g_inst/m_slot_7_axi_aw_cnt] [get_bd_pins ila_lib/probe146]
connect_bd_net -net net_slot_7_axi_awaddr [get_bd_pins g_inst/m_slot_7_axi_awaddr] [get_bd_pins ila_lib/probe147]
connect_bd_net -net net_slot_7_axi_awcache [get_bd_pins g_inst/m_slot_7_axi_awcache] [get_bd_pins ila_lib/probe148]
connect_bd_net -net net_slot_7_axi_awlen [get_bd_pins g_inst/m_slot_7_axi_awlen] [get_bd_pins ila_lib/probe149]
connect_bd_net -net net_slot_7_axi_awprot [get_bd_pins g_inst/m_slot_7_axi_awprot] [get_bd_pins ila_lib/probe150]
connect_bd_net -net net_slot_7_axi_awsize [get_bd_pins g_inst/m_slot_7_axi_awsize] [get_bd_pins ila_lib/probe151]
connect_bd_net -net net_slot_7_axi_b_cnt [get_bd_pins g_inst/m_slot_7_axi_b_cnt] [get_bd_pins ila_lib/probe152]
connect_bd_net -net net_slot_7_axi_r_cnt [get_bd_pins g_inst/m_slot_7_axi_r_cnt] [get_bd_pins ila_lib/probe153]
connect_bd_net -net net_slot_7_axi_rdata [get_bd_pins g_inst/m_slot_7_axi_rdata] [get_bd_pins ila_lib/probe154]
connect_bd_net -net net_slot_7_axi_rresp [get_bd_pins g_inst/m_slot_7_axi_rresp] [get_bd_pins ila_lib/probe155]
connect_bd_net -net net_slot_7_axi_wdata [get_bd_pins g_inst/m_slot_7_axi_wdata] [get_bd_pins ila_lib/probe156]
connect_bd_net -net net_slot_7_axi_aw_ctrl [get_bd_pins slot_7_aw/dout] [get_bd_pins ila_lib/probe157]
connect_bd_net -net net_slot_7_axi_awvalid [get_bd_pins g_inst/m_slot_7_axi_awvalid] [get_bd_pins slot_7_aw/In0]
connect_bd_net -net net_slot_7_axi_awready [get_bd_pins g_inst/m_slot_7_axi_awready] [get_bd_pins slot_7_aw/In1]
connect_bd_net -net net_slot_7_axi_w_ctrl [get_bd_pins slot_7_w/dout] [get_bd_pins ila_lib/probe158]
connect_bd_net -net net_slot_7_axi_wvalid [get_bd_pins g_inst/m_slot_7_axi_wvalid] [get_bd_pins slot_7_w/In0]
connect_bd_net -net net_slot_7_axi_wready [get_bd_pins g_inst/m_slot_7_axi_wready] [get_bd_pins slot_7_w/In1]
connect_bd_net -net net_slot_7_axi_wlast [get_bd_pins g_inst/m_slot_7_axi_wlast] [get_bd_pins slot_7_w/In2]
connect_bd_net -net net_slot_7_axi_b_ctrl [get_bd_pins slot_7_b/dout] [get_bd_pins ila_lib/probe159]
connect_bd_net -net net_slot_7_axi_bvalid [get_bd_pins g_inst/m_slot_7_axi_bvalid] [get_bd_pins slot_7_b/In0]
connect_bd_net -net net_slot_7_axi_bready [get_bd_pins g_inst/m_slot_7_axi_bready] [get_bd_pins slot_7_b/In1]
